# Altium project BEE-1012 PAY-EXP_V100.PrjPcb (part 1 of 4)
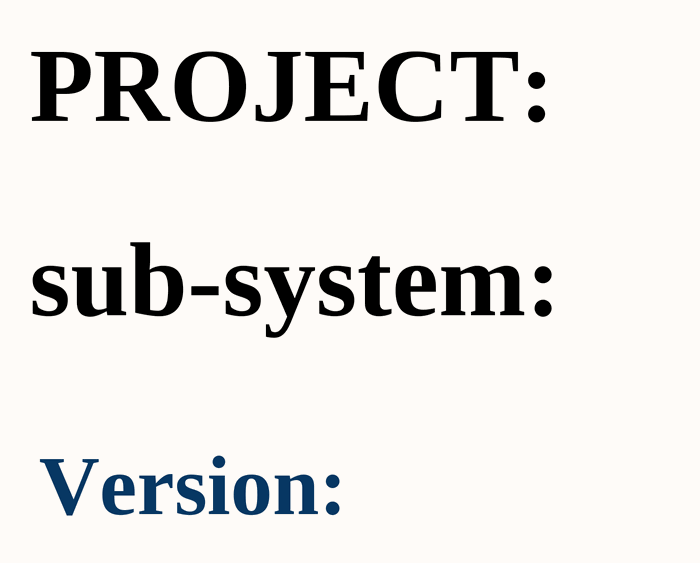
[diagram p0: 01_COVER PAGE.SchDoc]
ApprovedBy: Vu Pham; CheckedBy: Bao Bui; Date: 10/29/2025; DrawnBy: Cam Doan; MasterProject: BEE-PC; Revision: 1.0.0; SubSystem: EXP
33 sheets, 1301 parts. Net scope: flat (ports and power ports of the same name join across sheets).
Board file: BEE_1012 PAY-EXP V100.PcbDoc
Sheets:
  01_COVER PAGE.SchDoc
  02_BLOCK DIAGRAM.SchDoc
  03_INDEX.SchDoc
  04_POWER_TREE.SchDoc
  05_CONNECTOR_IN.SchDoc
  05_CONNECTOR_OUT.SchDoc
  06_POWER_1.SchDoc
  06_POWER_2.SchDoc
  06_POWER_3.SchDoc
  06_POWER_4.SchDoc
  06_POWER_5.SchDoc
  07_CAN.SchDoc
  08_SAMA7G54-MPU.SchDoc
  08_SAMA7G54-PMIC.SchDoc
  08_SAMA7G54-PIO.SchDoc
  08_SAMA7G54-DDR3.SchDoc
  08_SOM_USB_CARD.SchDoc
  09_eMMC.SchDoc
  10_USB.SchDoc
  11_MCU.SchDoc
  12_CONSOLE.SchDoc
  13_MRAM_RTC_WDT.SchDoc
  14_NTC_TEMPSENSOR.SchDoc
  15_HEATER.SchDoc
  16_TEC.SchDoc
  17_FLOW_Sensor.SchDoc
  17_I2C_Sensor_OnBoard.SchDoc
  18_HD4_PUMP.SchDoc
  18_HD4_PUMP_2.SchDoc
  19_SOLEDNOID_1.SchDoc
  19_SOLEDNOID_2.SchDoc
  MOUTING.SchDoc
  ANA_SWITCH.SchDoc

## Sheet 01_COVER PAGE.SchDoc
size 420 x 297 mm; DrawnBy: Sang Huynh; SheetNumber: 1; SheetTotal: 33; MasterProject: BEE-1012

### Notes on the sheet
- PROJECT:
- sub-system:
- Version:
- Project:
- BEE-1012
- Sub-system:
- SATELLITE_EXP_CONTROLLER
- Design by:
- SANG HUYNH
- BAO BUI
- Sheet title:
- Sheet
- A3
- of
- Checked by:
- Approved by:
- VU PHAM
- Revision:
- Document No:
- Size:
- Date:

## Sheet 02_BLOCK DIAGRAM.SchDoc
size 420 x 297 mm; SheetNumber: 2; SheetTotal: 33

### Notes on the sheet
- Project:
- BEE-1012
- Sub-system:
- SATELLITE_EXP_CONTROLLER
- Design by:
- SANG HUYNH
- BAO BUI
- Sheet title:
- Sheet
- A3
- of
- Checked by:
- Approved by:
- VU PHAM
- Revision:
- Document No:
- Size:
- Date:

## Sheet 03_INDEX.SchDoc
size 420 x 297 mm; SheetNumber: 3; SheetTotal: 33
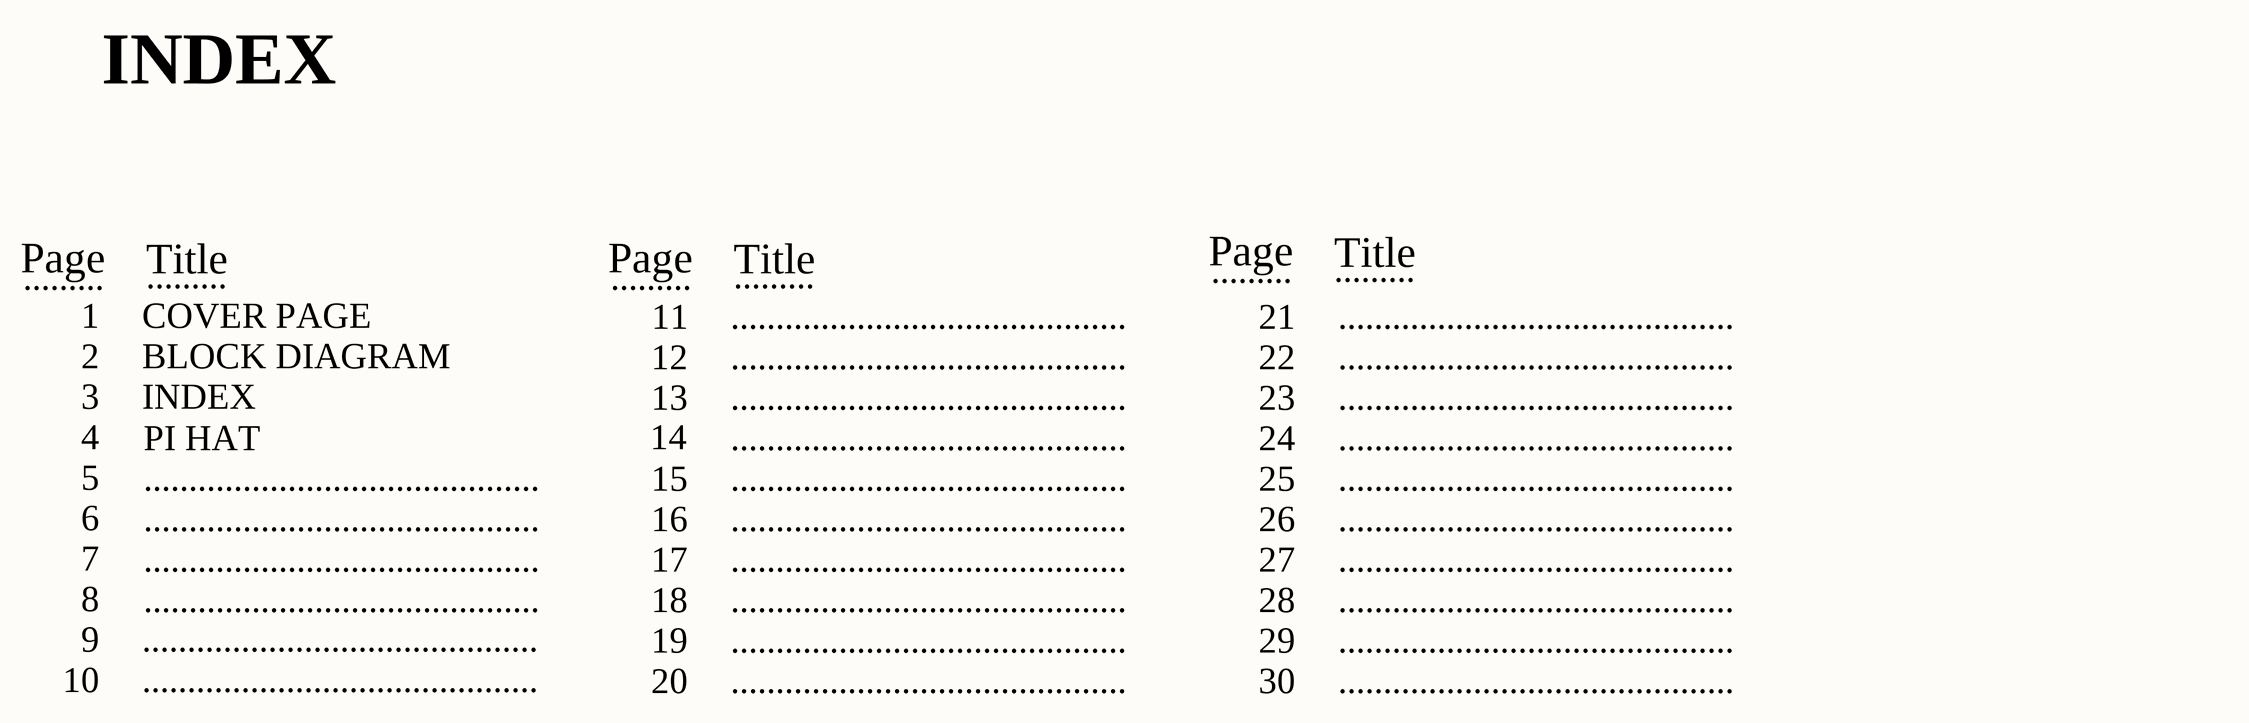
[diagram p1: 03_INDEX.SchDoc]

### Notes on the sheet
- INDEX
- Page
- .........
- Title
- 1
- 2
- COVER PAGE
- BLOCK DIAGRAM
- 11
- 12
- ............................................
- 21
- 22
- 3
- 4
- 14
- 13
- 23
- 5
- PI HAT
- 15
- 24
- 25
- 6
- 7
- 16
- 17
- 26
- 27
- 8
- 18
- 28
- 9
- 10
- 19
- 20
- 29
- 30
- Project:
- BEE-1012
- Sub-system:
- SATELLITE_EXP_CONTROLLER
- Design by:
- SANG HUYNH
- BAO BUI
- Sheet title:
- Sheet
- A3
- of
- Checked by:
- Approved by:
- VU PHAM
- Revision:
- Document No:
- Size:
- Date:

## Sheet 04_POWER_TREE.SchDoc
size 420 x 297 mm; SheetNumber: 4; SheetTotal: 33
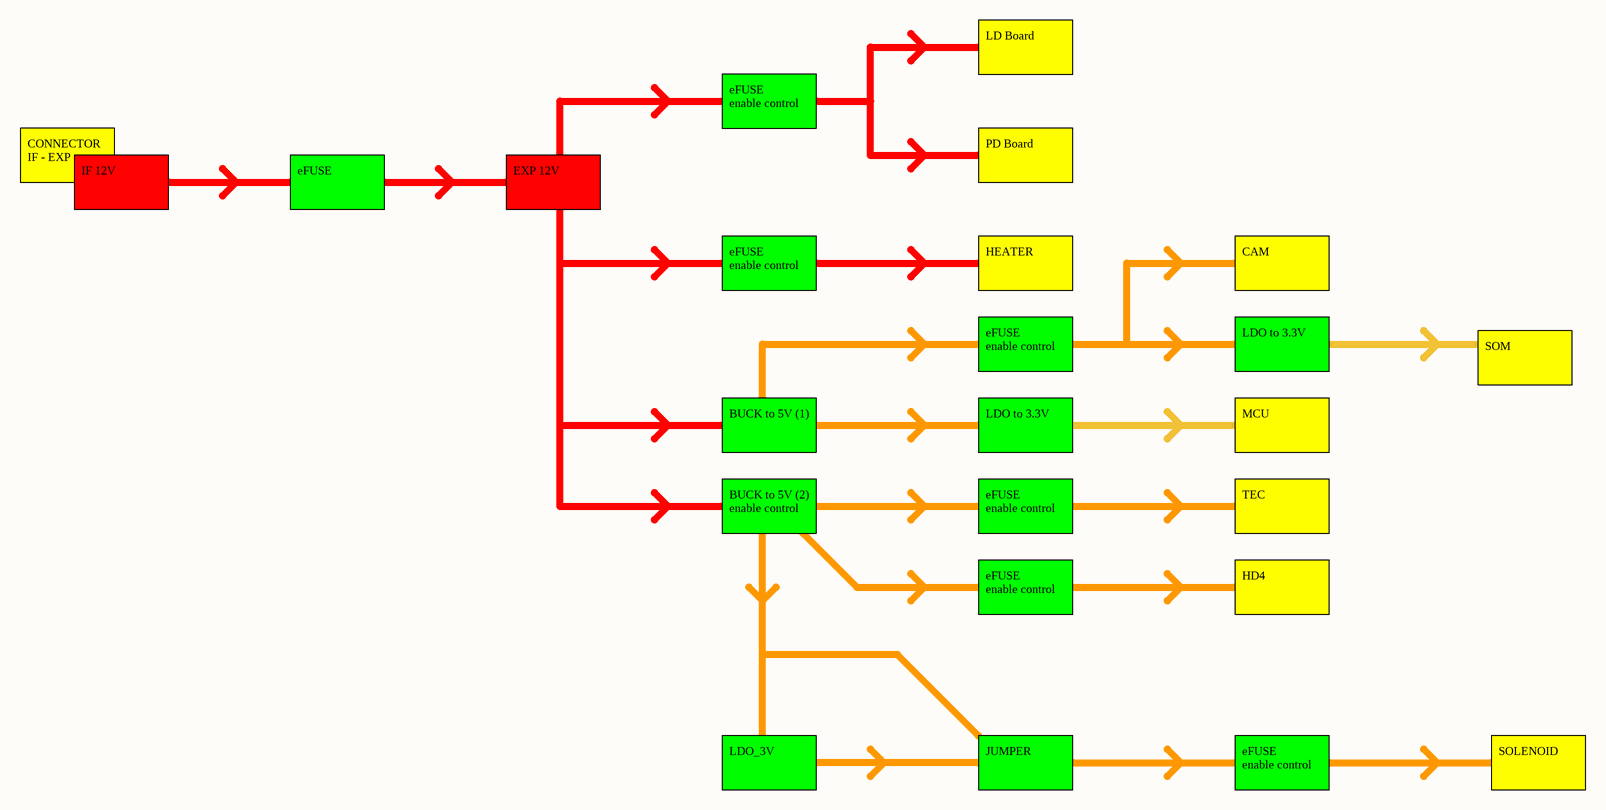
[diagram p2: 04_POWER_TREE.SchDoc]

### Notes on the sheet
- LD Board
- eFUSE
  enable control
- CONNECTOR
  IF - EXP
- IF 12V
- eFUSE
- EXP 12V
- PD Board
- HEATER
- CAM
- LDO to 3.3V
- SOM
- BUCK to 5V (1)
- MCU
- BUCK to 5V (2)
  enable control
- TEC
- HD4
- LDO_3V
- JUMPER
- SOLENOID
- Project:
- BEE-1012
- Sub-system:
- SATELLITE_EXP_CONTROLLER
- Design by:
- SANG HUYNH
- BAO BUI
- Sheet title:
- Sheet
- A3
- of
- Checked by:
- Approved by:
- VU PHAM
- Revision:
- Document No:
- Size:
- Date:

## Sheet 05_CONNECTOR_IN.SchDoc
size 420 x 297 mm; SheetNumber: 5; SheetTotal: 33
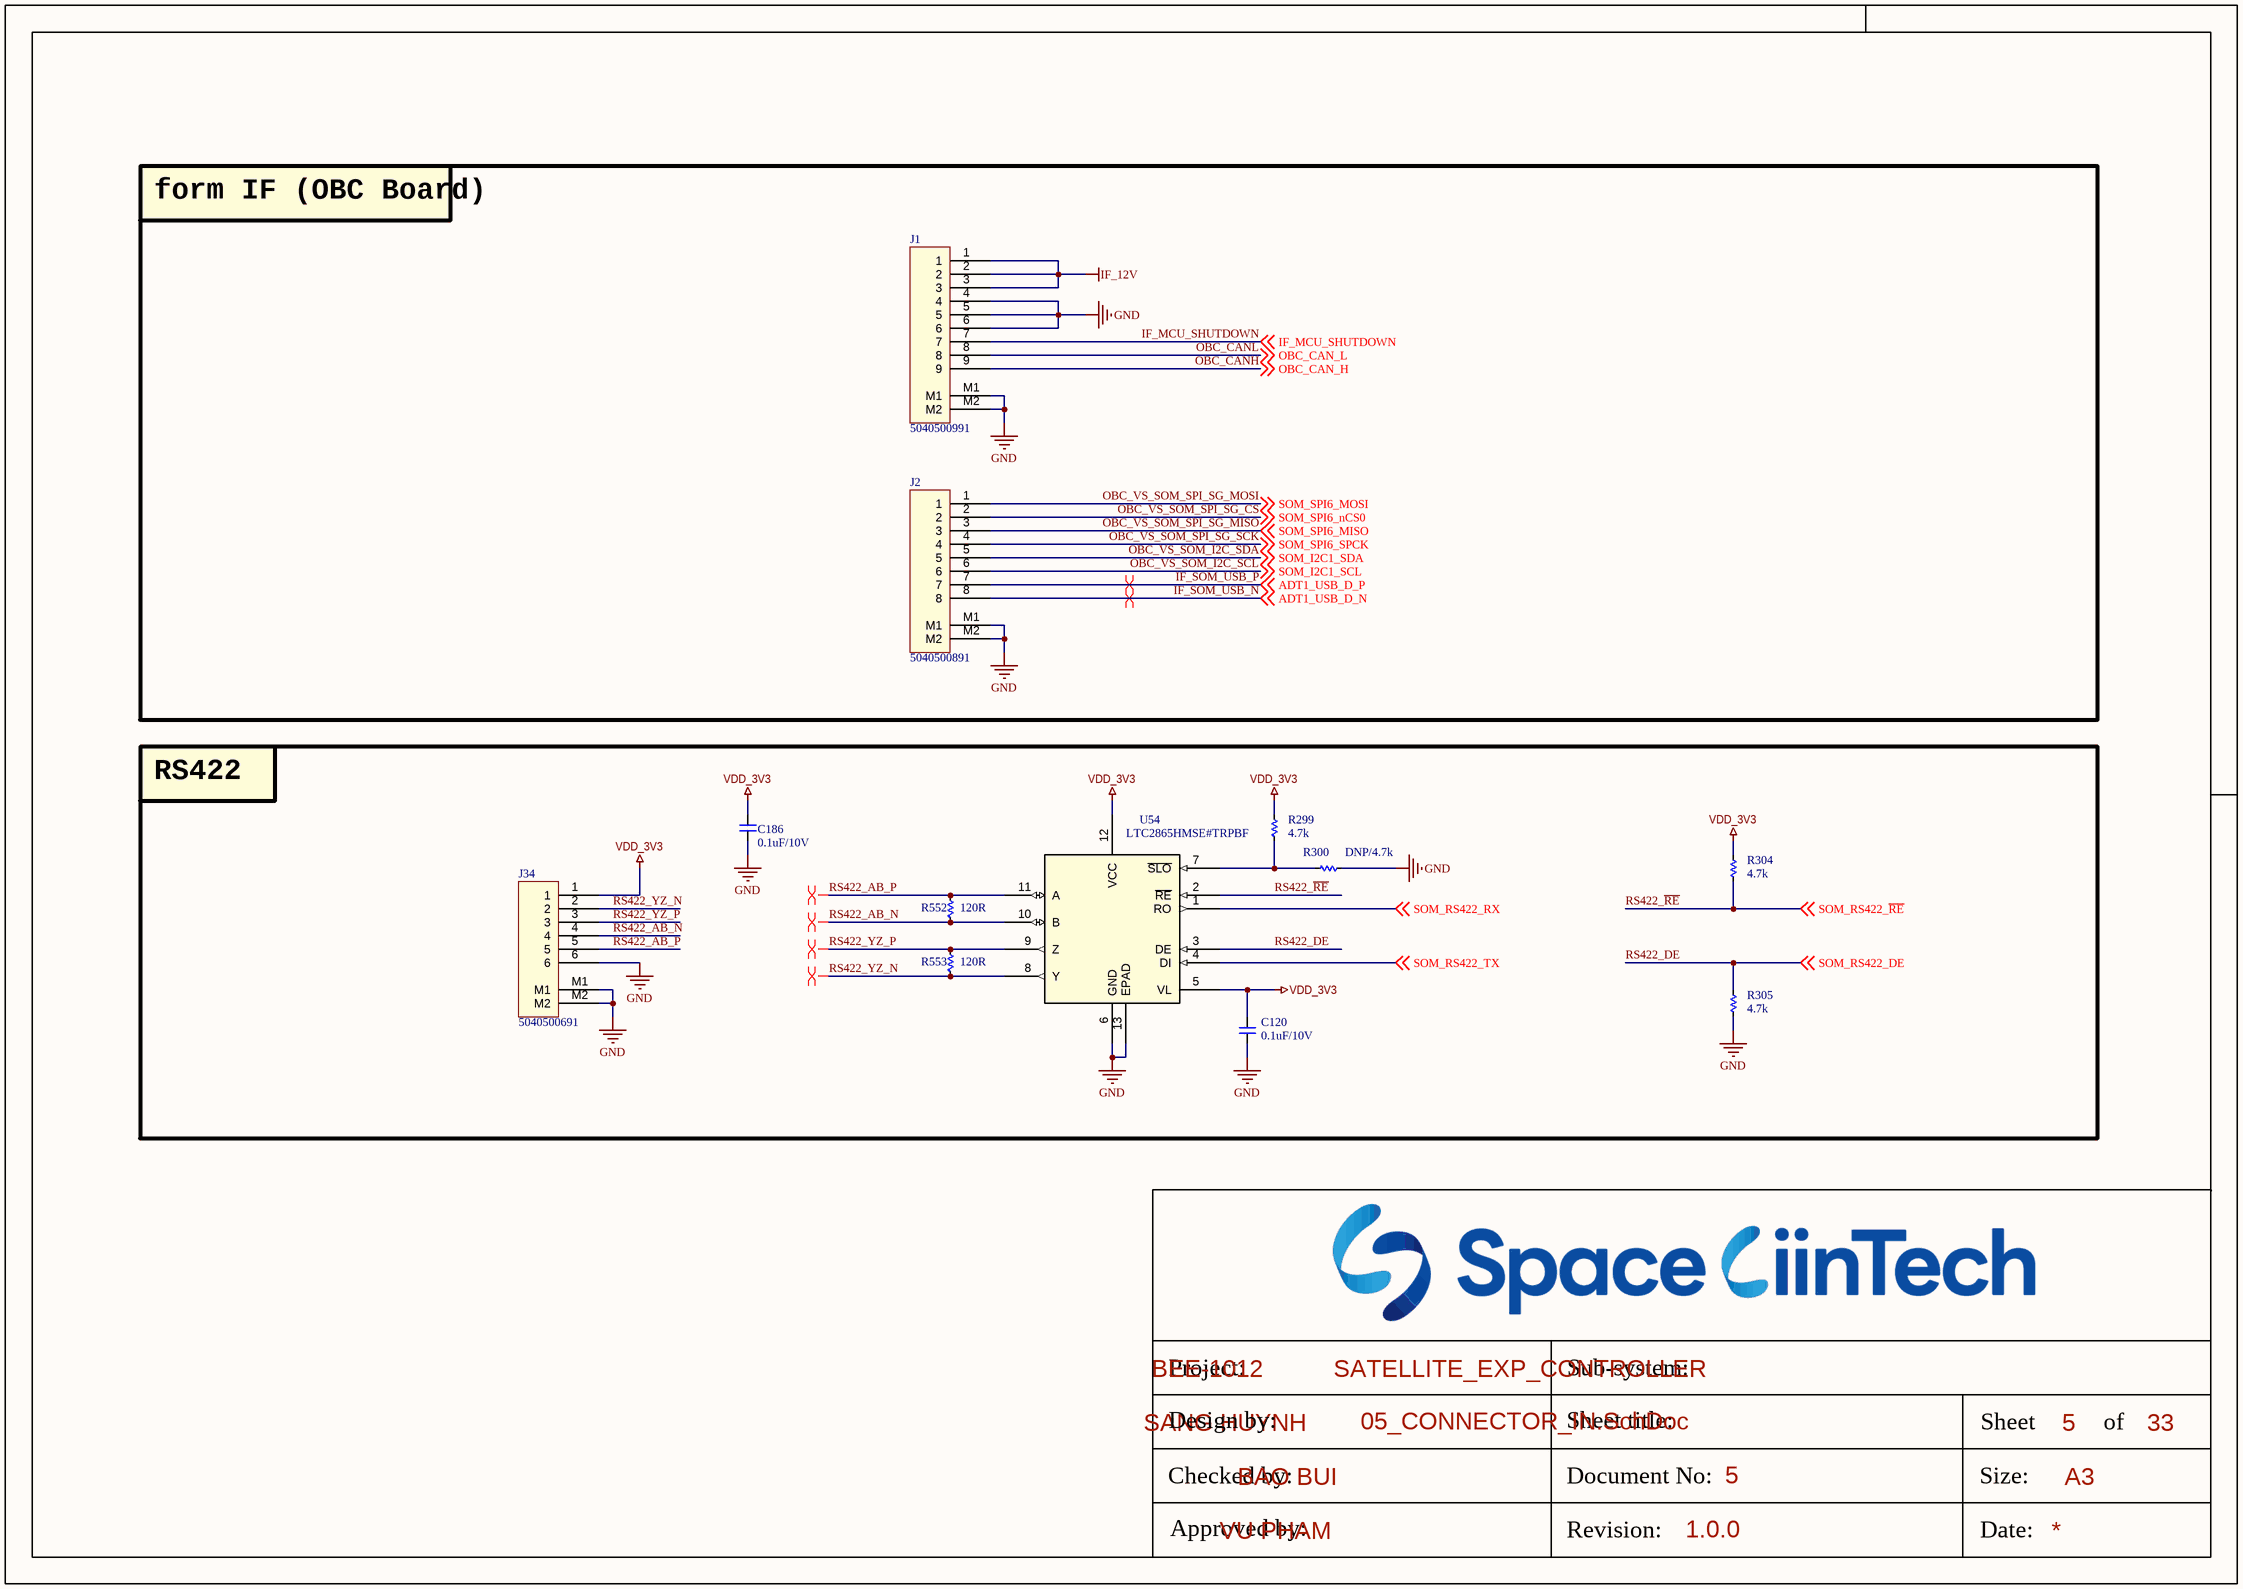
[diagram p3: 05_CONNECTOR_IN.SchDoc]

### Parts
C120  0.1uF/10V  [CAP_C_1005X50_L]
C186  0.1uF/10V  [CAP_C_1005X50_L]
J1  5040500991  [MOLEX_5040500991]
J2  5040500891  [MOLEX_5040500891]
J34  5040500691  [MOLEX_5040500691]
R299  4.7k  [RES_C_1005x30_L]
R300  DNP/4.7k  [RES_C_1005x30_L]
R304  4.7k  [RES_C_1005x30_L]
R305  4.7k  [RES_C_1005x30_L]
R552  120R  [RES_C_1005x30_L]
R553  120R  [RES_C_1005x30_L]
U54  LTC2865HMSE#TRPBF  [MSOP-12_MSE_LIT]

### Blocks framed on the sheet
form IF (OBC Board): J1 J2
RS422: C120 C186 J34 R299 R300 R304 R305 R552 R553 U54

### Nets
GND: C120.1 C186.1 J1.4 J1.5 J1.6 J1.M1 J1.M2 J2.M1 J2.M2 J34.6 J34.M1 J34.M2 R300.2 R305.1 U54.6(GND) U54.13(EPAD)
IF_12V: J1.1 J1.2 J1.3
VDD_3V3: C120.2 C186.2 J34.1 R299.1 R304.1 U54.5(VL) U54.12(VCC)
IF_MCU_SHUTDOWN: J1.7 ; off-sheet IF_MCU_SHUTDOWN
IF_SOM_USB_N: J2.8 ; off-sheet ADT1_USB_D_N  [also labelled ADT1_USB_D_N]
IF_SOM_USB_P: J2.7 ; off-sheet ADT1_USB_D_P  [also labelled ADT1_USB_D_P]
OBC_CANH: J1.9 ; off-sheet OBC_CAN_H  [also labelled OBC_CAN_H]
OBC_CANL: J1.8 ; off-sheet OBC_CAN_L  [also labelled OBC_CAN_L]
OBC_VS_SOM_I2C_SCL: J2.6 ; off-sheet SOM_I2C1_SCL  [also labelled SOM_I2C1_SCL]
OBC_VS_SOM_I2C_SDA: J2.5 ; off-sheet SOM_I2C1_SDA  [also labelled SOM_I2C1_SDA]
OBC_VS_SOM_SPI_SG_CS: J2.2 ; off-sheet SOM_SPI6_nCS0  [also labelled SOM_SPI6_nCS0]
OBC_VS_SOM_SPI_SG_MISO: J2.3 ; off-sheet SOM_SPI6_MISO  [also labelled SOM_SPI6_MISO]
OBC_VS_SOM_SPI_SG_MOSI: J2.1 ; off-sheet SOM_SPI6_MOSI  [also labelled SOM_SPI6_MOSI]
OBC_VS_SOM_SPI_SG_SCK: J2.4 ; off-sheet SOM_SPI6_SPCK  [also labelled SOM_SPI6_SPCK]
RS422_AB_N: J34.4 R552.2 U54.10(B)
RS422_AB_P: J34.5 R552.1 U54.11(A)
RS422_DE: R305.2 U54.3(DE) ; off-sheet SOM_RS422_DE  [also labelled SOM_RS422_DE]
RS422_~{RE}: R304.2 U54.2(~{RE}) ; off-sheet SOM_RS422_~{RE}  [also labelled SOM_RS422_~{RE}]
RS422_YZ_N: J34.2 R553.2 U54.8(Y)
RS422_YZ_P: J34.3 R553.1 U54.9(Z)
SOM_RS422_RX: U54.1(RO) ; off-sheet SOM_RS422_RX
SOM_RS422_TX: U54.4(DI) ; off-sheet SOM_RS422_TX
NetR299_2: R299.2 R300.1 U54.7(~{SLO})

### Layout directives
differential pair: IF_SOM_USB_N, IF_SOM_USB_P, RS422_AB_N, RS422_AB_P, RS422_YZ_N, RS422_YZ_P

### Notes on the sheet
- Project:
- BEE-1012
- Sub-system:
- SATELLITE_EXP_CONTROLLER
- Design by:
- SANG HUYNH
- BAO BUI
- Sheet title:
- Sheet
- A3
- of
- Checked by:
- Approved by:
- VU PHAM
- Revision:
- Document No:
- Size:
- Date:

### Library data of the parts
C120 C186 = _CAP_C_2: CAP CHIP
J1 = Header 9x1_2M
J2 = Header 8x1_2M
J34 = Header 6x1_2M
R299 R300 R304 R305 R552 R553 = _RES_B_2: RES
U54 = LTC2865HMSETRPBF: Â±60V Fault Protected 3V to 5.5V RS485/RS422 Transceivers; Manufacturer_Name: Analog Devices Inc; Copyright: Copyright (C) 2025 Ultra Librarian. All rights reserved.; Manufacturer_Part_Number: LTC2865HMSE#TRPBF; RefDes: RefDes; Type: Type

## Sheet 05_CONNECTOR_OUT.SchDoc
size 420 x 297 mm; SheetNumber: 6; SheetTotal: 33
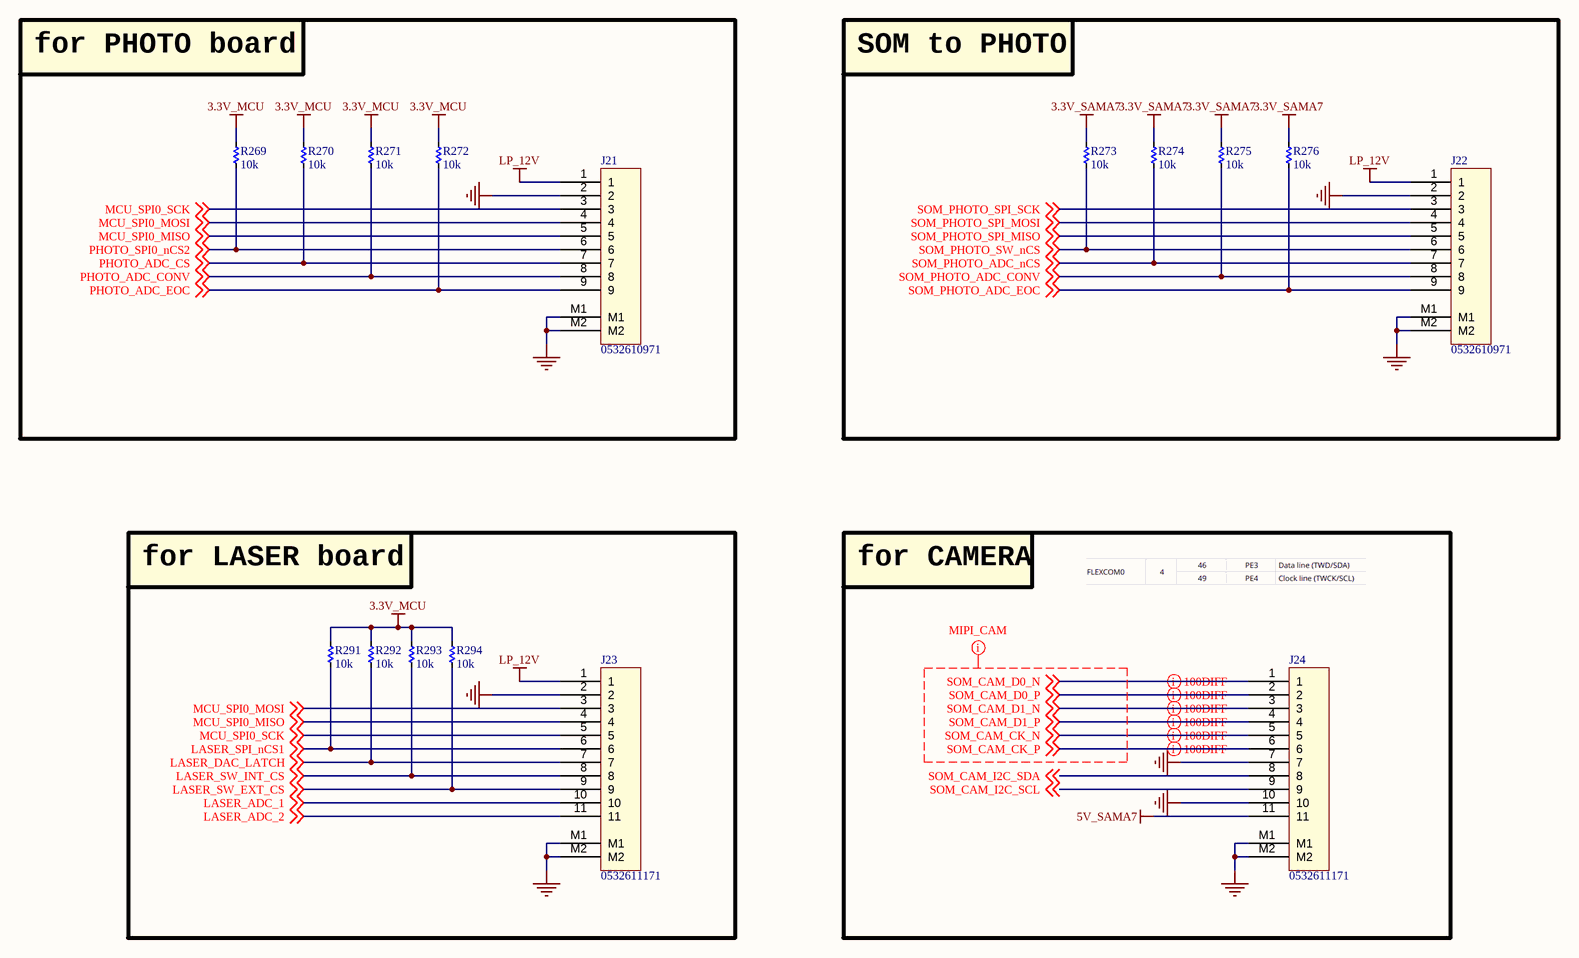
[diagram p4: 05_CONNECTOR_OUT.SchDoc]

### Parts
J21  0532610971  [MOLEX_0532610971]
J22  0532610971  [MOLEX_0532610971]
J23  0532611171  [MOLEX_0532611171]
J24  0532611171  [MOLEX_0532611171]
R269  10k  [RES_C_1005x30_L]
R270  10k  [RES_C_1005x30_L]
R271  10k  [RES_C_1005x30_L]
R272  10k  [RES_C_1005x30_L]
R273  10k  [RES_C_1005x30_L]
R274  10k  [RES_C_1005x30_L]
R275  10k  [RES_C_1005x30_L]
R276  10k  [RES_C_1005x30_L]
R291  10k  [RES_C_1005x30_L]
R292  10k  [RES_C_1005x30_L]
R293  10k  [RES_C_1005x30_L]
R294  10k  [RES_C_1005x30_L]

### Blocks framed on the sheet
for PHOTO board: J21 R269-R272
SOM to PHOTO: J22 R273-R276
for LASER board: J23 R291-R294
for CAMERA: J24

### Nets
3.3V_MCU: R269.1 R270.1 R271.1 R272.1 R291.1 R292.1 R293.1 R294.1
3.3V_SAMA7: R273.1 R274.1 R275.1 R276.1
5V_SAMA7: J24.11
GND: J21.2 J21.M1 J21.M2 J22.2 J22.M1 J22.M2 J23.2 J23.M1 J23.M2 J24.7 J24.10 J24.M1 J24.M2
LP_12V: J21.1 J22.1 J23.1
LASER_ADC_1: J23.10 ; off-sheet LASER_ADC_1
LASER_ADC_2: J23.11 ; off-sheet LASER_ADC_2
LASER_DAC_LATCH: J23.7 R292.2 ; off-sheet LASER_DAC_LATCH
LASER_SPI_nCS1: J23.6 R291.2 ; off-sheet LASER_SPI_nCS1
LASER_SW_EXT_CS: J23.9 R294.2 ; off-sheet LASER_SW_EXT_CS
LASER_SW_INT_CS: J23.8 R293.2 ; off-sheet LASER_SW_INT_CS
MCU_SPI0_MISO: J21.5 J23.4 ; off-sheet MCU_SPI0_MISO
MCU_SPI0_MOSI: J21.4 J23.3 ; off-sheet MCU_SPI0_MOSI
MCU_SPI0_SCK: J21.3 J23.5 ; off-sheet MCU_SPI0_SCK
PHOTO_ADC_CONV: J21.8 R271.2 ; off-sheet PHOTO_ADC_CONV
PHOTO_ADC_CS: J21.7 R270.2 ; off-sheet PHOTO_ADC_CS
PHOTO_ADC_EOC: J21.9 R272.2 ; off-sheet PHOTO_ADC_EOC
PHOTO_SPI0_nCS2: J21.6 R269.2 ; off-sheet PHOTO_SPI0_nCS2
SOM_CAM_CK_N: J24.5 ; off-sheet SOM_CAM_CK_N  [project net MIPI_CK_N]
SOM_CAM_CK_P: J24.6 ; off-sheet SOM_CAM_CK_P  [project net MIPI_CK_P]
SOM_CAM_D0_N: J24.1 ; off-sheet SOM_CAM_D0_N  [project net MIPI_D0_N]
SOM_CAM_D0_P: J24.2 ; off-sheet SOM_CAM_D0_P  [project net MIPI_D0_P]
SOM_CAM_D1_N: J24.3 ; off-sheet SOM_CAM_D1_N  [project net MIPI_D1_N]
SOM_CAM_D1_P: J24.4 ; off-sheet SOM_CAM_D1_P  [project net MIPI_D1_P]
SOM_CAM_I2C_SCL: J24.9 ; off-sheet SOM_CAM_I2C_SCL
SOM_CAM_I2C_SDA: J24.8 ; off-sheet SOM_CAM_I2C_SDA
SOM_PHOTO_ADC_CONV: J22.8 R275.2 ; off-sheet SOM_PHOTO_ADC_CONV
SOM_PHOTO_ADC_EOC: J22.9 R276.2 ; off-sheet SOM_PHOTO_ADC_EOC
SOM_PHOTO_ADC_nCS: J22.7 R274.2 ; off-sheet SOM_PHOTO_ADC_nCS
SOM_PHOTO_SPI_MISO: J22.5 ; off-sheet SOM_PHOTO_SPI_MISO
SOM_PHOTO_SPI_MOSI: J22.4 ; off-sheet SOM_PHOTO_SPI_MOSI
SOM_PHOTO_SPI_SCK: J22.3 ; off-sheet SOM_PHOTO_SPI_SCK
SOM_PHOTO_SW_nCS: J22.6 R273.2 ; off-sheet SOM_PHOTO_SW_nCS

### Layout directives
differential pair; differential pair class DIFF100: MIPI_CK_N, MIPI_CK_P, MIPI_D0_N, MIPI_D0_P, MIPI_D1_N, MIPI_D1_P
net class MIPI_CAM: SOM_CAM_CK_N, SOM_CAM_CK_P, SOM_CAM_D0_N, SOM_CAM_D0_P, SOM_CAM_D1_N, SOM_CAM_D1_P

### Notes on the sheet
- Project:
- BEE-1012
- Sub-system:
- SATELLITE_EXP_CONTROLLER
- Design by:
- SANG HUYNH
- BAO BUI
- Sheet title:
- Sheet
- A3
- of
- Checked by:
- Approved by:
- VU PHAM
- Revision:
- Document No:
- Size:
- Date:

### Library data of the parts
J21 J22 = Header 9x1_2M
J23 J24 = Header 11x1_2M
R269-R276 R291-R294 = _RES_B_2: RES

## Sheet 06_POWER_1.SchDoc
size 420 x 297 mm; SheetNumber: 7; SheetTotal: 33
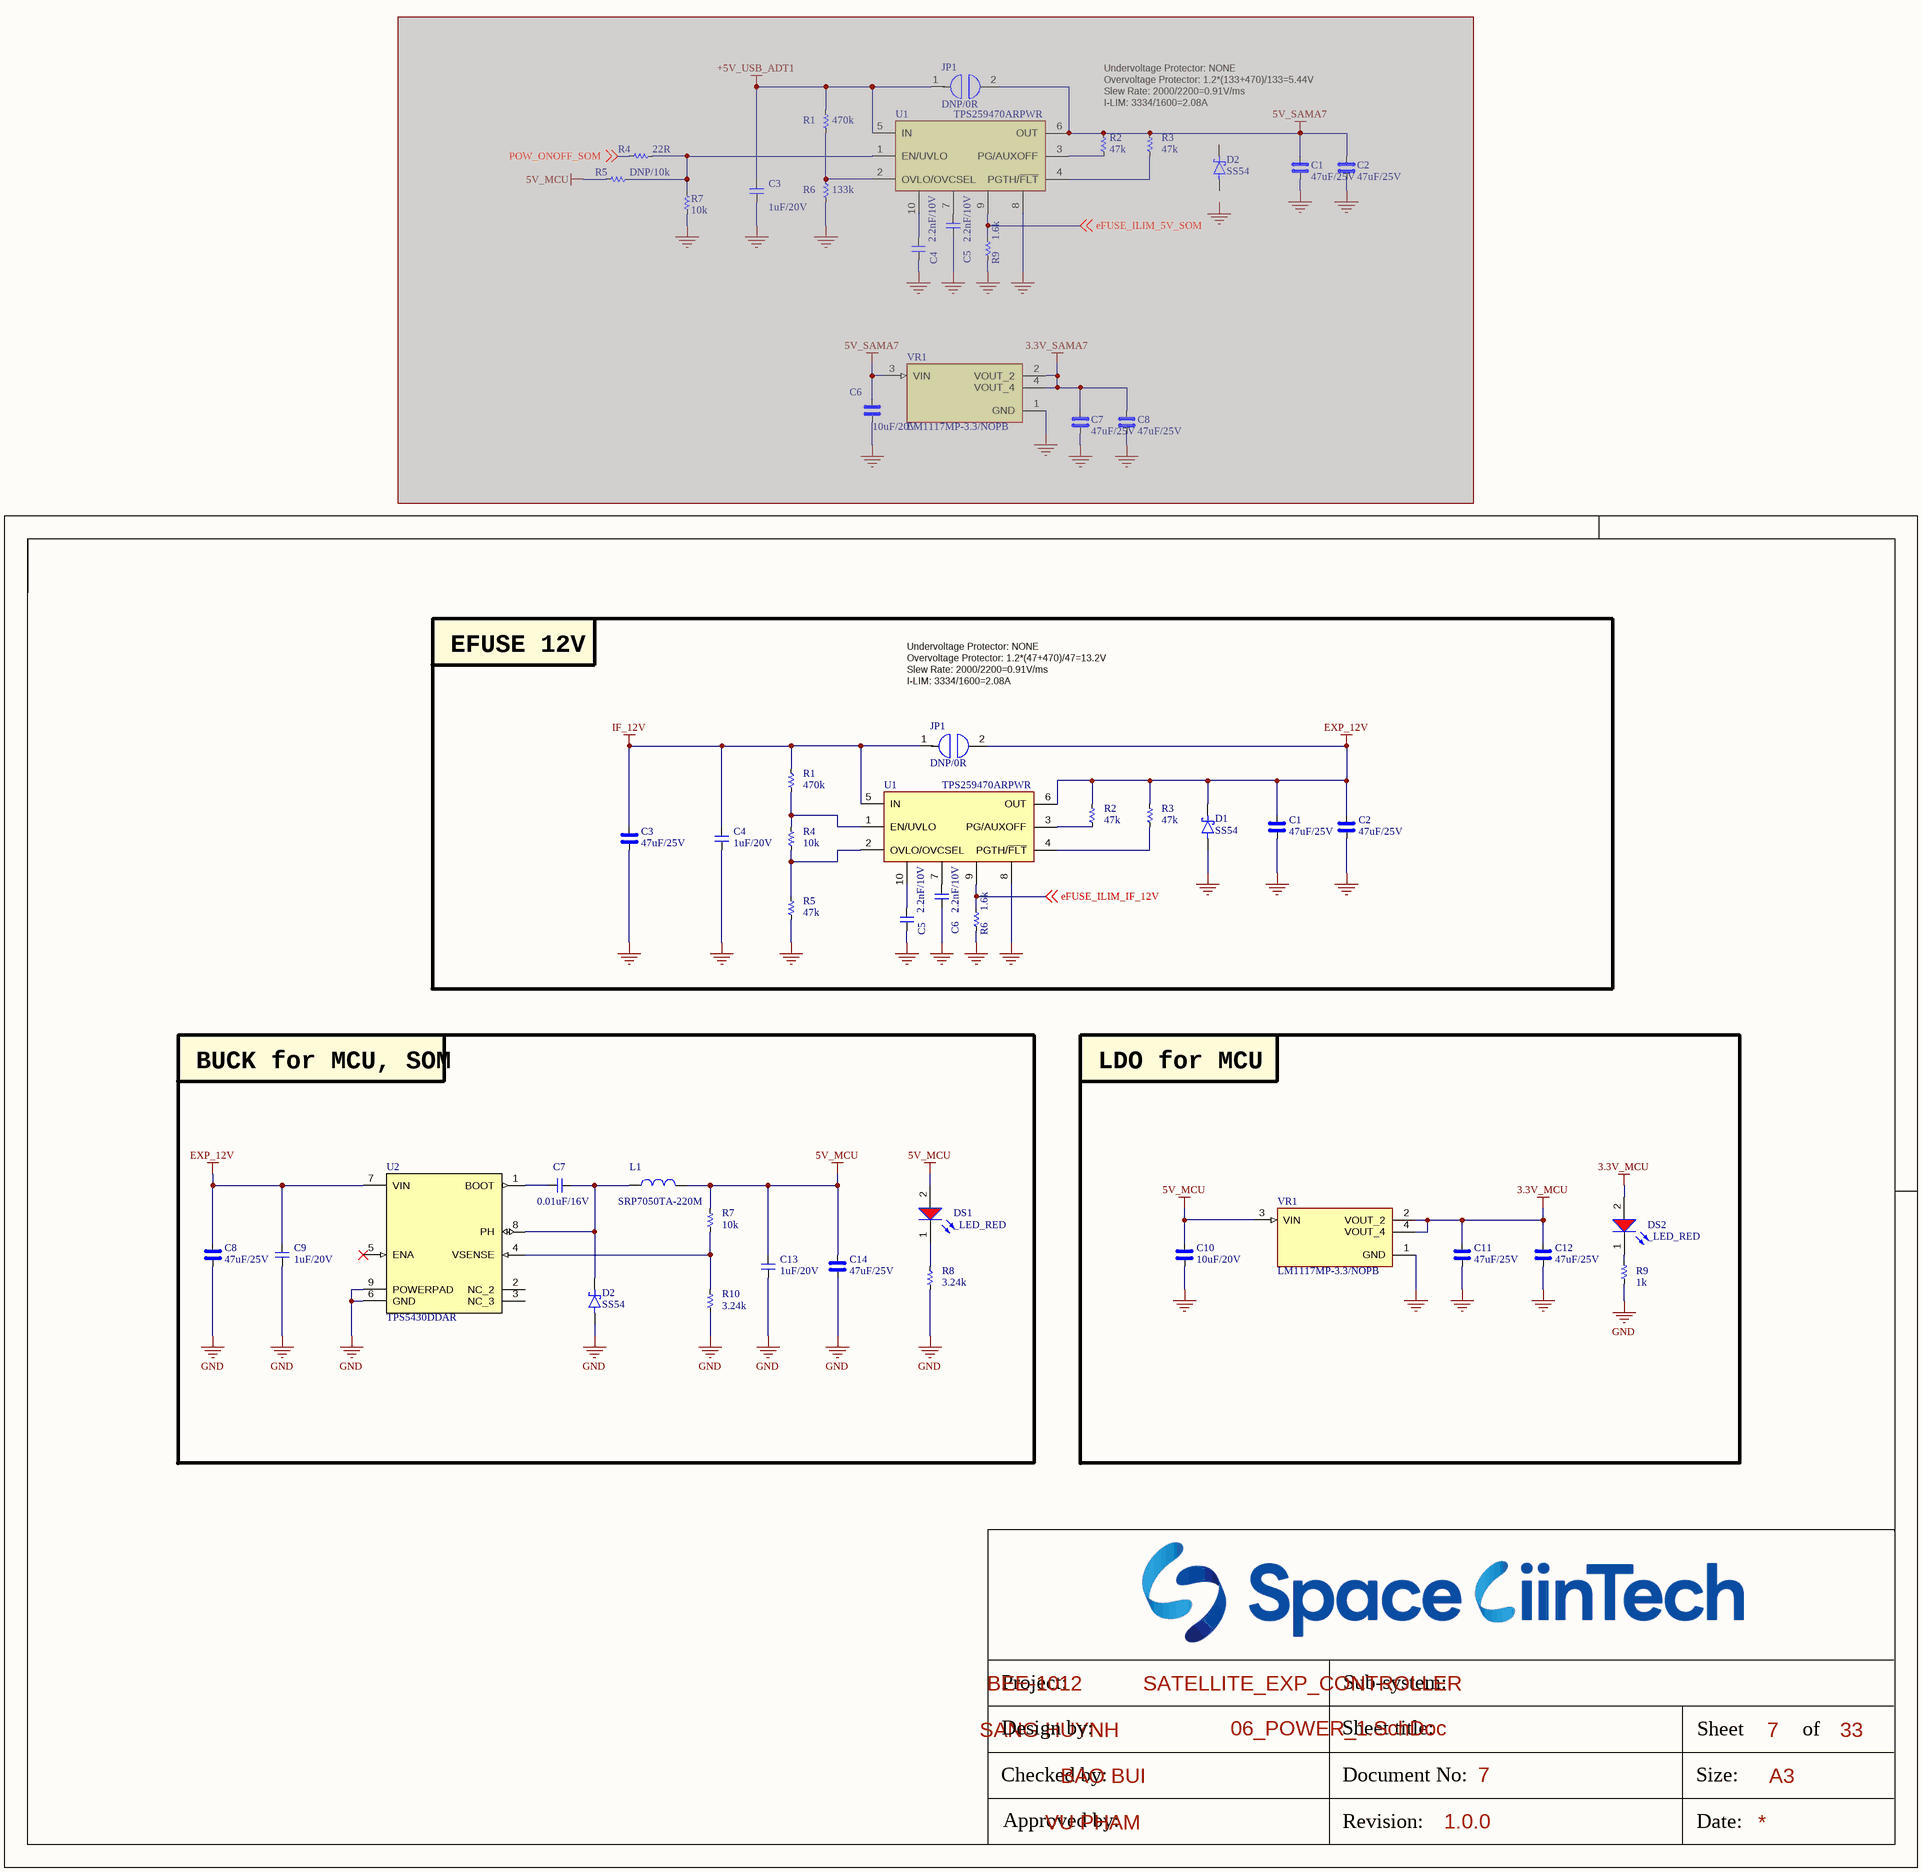
[diagram p5: 06_POWER_1.SchDoc]

### Parts
(Parts that share a designator on the sheet are numbered #1, #2 ... from top to bottom, then left to right.)
C1#1  47uF/25V  [CAP_C_3225X80]  (masked out: inside a compile mask, not in the netlist)
C1#2  47uF/25V  [CAP_C_3225X80]
C2#1  47uF/25V  [CAP_C_3225X80]  (masked out: inside a compile mask, not in the netlist)
C2#2  47uF/25V  [CAP_C_3225X80]
C3#1  1uF/20V  [CAP_C_1005X50_L]  (masked out: inside a compile mask, not in the netlist)
C3#2  47uF/25V  [CAP_C_3225X80]
C4#1  2.2nF/10V  [CAP_C_1005X50_L]  (masked out: inside a compile mask, not in the netlist)
C4#2  1uF/20V  [CAP_C_1005X50_L]
C5#1  2.2nF/10V  [CAP_C_1005X50_L]  (masked out: inside a compile mask, not in the netlist)
C5#2  2.2nF/10V  [CAP_C_1005X50_L]
C6#1  10uF/20V  [CAP_C_2012X110]  (masked out: inside a compile mask, not in the netlist)
C6#2  2.2nF/10V  [CAP_C_1005X50_L]
C7#1  47uF/25V  [CAP_C_3225X80]  (masked out: inside a compile mask, not in the netlist)
C7#2  0.01uF/16V  [CAP_C_1608X80]
C8#1  47uF/25V  [CAP_C_3225X80]  (masked out: inside a compile mask, not in the netlist)
C8#2  47uF/25V  [CAP_C_3225X80]
C9  1uF/20V  [CAP_C_1005X50_L]
C10  10uF/20V  [CAP_C_2012X110]
C11  47uF/25V  [CAP_C_3225X80]
C12  47uF/25V  [CAP_C_3225X80]
C13  1uF/20V  [CAP_C_1005X50_L]
C14  47uF/25V  [CAP_C_3225X80]
D1  SS54  [DO-214AC_SMA]
D2#1  SS54  [DO-214AC_SMA]  (masked out: inside a compile mask, not in the netlist)
D2#2  SS54  [DO-214AC_SMA]
DS1  _LED_RED  [LED_0402]
DS2  _LED_RED  [LED_0402]
JP1#1  DNP/0R  [JUMPER_1608]  (masked out: inside a compile mask, not in the netlist)
JP1#2  DNP/0R  [JUMPER_1608]
L1  SRP7050TA-220M  [PSM6050]
R1#1  470k  [RES_C_1005x30_L]  (masked out: inside a compile mask, not in the netlist)
R1#2  470k  [RES_C_1005x30_L]
R2#1  47k  [RES_C_1005x30_L]  (masked out: inside a compile mask, not in the netlist)
R2#2  47k  [RES_C_1005x30_L]
R3#1  47k  [RES_C_1005x30_L]  (masked out: inside a compile mask, not in the netlist)
R3#2  47k  [RES_C_1005x30_L]
R4#1  22R  [RES_C_1005x30_L]  (masked out: inside a compile mask, not in the netlist)
R4#2  10k  [RES_C_1005x30_L]
R5#1  DNP/10k  [RES_C_1005x30_L]  (masked out: inside a compile mask, not in the netlist)
R5#2  47k  [RES_C_1005x30_L]
R6#1  133k  [RES_C_1005x30_L]  (masked out: inside a compile mask, not in the netlist)
R6#2  1.6k  [RES_C_1005x30_L]
R7#1  10k  [RES_C_1005x30_L]  (masked out: inside a compile mask, not in the netlist)
R7#2  10k  [RES_C_1005x30_L]
R8  3.24k  [RES_C_1005x30_L]
R9#1  1.6k  [RES_C_1005x30_L]  (masked out: inside a compile mask, not in the netlist)
R9#2  1k  [RES_C_1005x30_L]
R10  3.24k  [RES_C_1005x30_L]
U1#1  TPS259470ARPWR  [VQFN-HR-10]  (masked out: inside a compile mask, not in the netlist)
U1#2  TPS259470ARPWR  [VQFN-HR-10]
U2  TPS5430DDAR  [TPS5430DDAR_V3]
VR1#1  LM1117MP-3.3/NOPB  [VREG_LM1117MP-3.3/NOPB]  (masked out: inside a compile mask, not in the netlist)
VR1#2  LM1117MP-3.3/NOPB  [VREG_LM1117MP-3.3/NOPB]

### Blocks framed on the sheet
EFUSE 12V: C1#2 C2#2 C3#2 C4#2 C5#2 C6#2 D1 JP1#2 R1#2 R2#2 R3#2 R4#2 R5#2 R6#2 U1#2
BUCK for MCU, SOM: C7#2 C8#2 C9 C13 C14 D2#2 DS1 L1 R7#2 R8 R10 U2
LDO for MCU: C10-C12 DS2 R9#2 VR1#2

### Nets
3.3V_MCU: C11.2 C12.2 DS2.2(A) VR1#2.2(VOUT_2) VR1#2.4(VOUT_4)
5V_MCU: C10.1 C13.2 C14.2 DS1.2(A) L1.2 R7#2.2 VR1#2.3(VIN)
EXP_12V: C1#2.2 C2#2.2 C8#2.2 C9.2 D1.1(K) JP1#2.2 R2#2.2 R3#2.2 U1#2.6(OUT) U2.7(VIN)
GND: C1#2.1 C2#2.1 C3#2.1 C4#2.1 C5#2.1 C6#2.1 C8#2.1 C9.1 C10.2 C11.1 C12.1 C13.1 C14.1 D1.2(A) D2#2.2(A) R5#2.1 R6#2.1 R8.1 R9#2.1 R10.1 U1#2.8 U2.6(GND) U2.9(POWERPAD) VR1#2.1(GND)
IF_12V: C3#2.2 C4#2.2 JP1#2.1 R1#2.2 U1#2.5(IN)
eFUSE_ILIM_IF_12V: R6#2.2 U1#2.9 ; off-sheet eFUSE_ILIM_IF_12V
NetC5#2_2: C5#2.2 U1#2.10
NetC6#2_2: C6#2.2 U1#2.7
NetC7#2_1: C7#2.1 D2#2.1(K) L1.1 U2.8(PH)
NetC7#2_2: C7#2.2 U2.1(BOOT)
NetDS1_1: DS1.1(K) R8.2
NetDS2_1: DS2.1(K) R9#2.2
NetR1#2_1: R1#2.1 R4#2.1 U1#2.1(EN/UVLO)
NetR2#2_1: R2#2.1 U1#2.3(PG/AUXOFF)
NetR3#2_1: R3#2.1 U1#2.4(PGTH/~{FLT})
NetR4#2_2: R4#2.2 R5#2.2 U1#2.2(OVLO/OVCSEL)
NetR7#2_1: R7#2.1 R10.2 U2.4(VSENSE)

Not connected (* = marked no-connect by the designer): U2 2(NC_2) 3(NC_3) 5(ENA)*

### Notes on the sheet
- Undervoltage Protector: NONE
- Overvoltage Protector: 1.2*(133+470)/133=5.44V
- Slew Rate: 2000/2200=0.91V/ms
- I-LIM: 3334/1600=2.08A
- Overvoltage Protector: 1.2*(47+470)/47=13.2V
- Project:
- BEE-1012
- Sub-system:
- SATELLITE_EXP_CONTROLLER
- Design by:
- SANG HUYNH
- BAO BUI
- Sheet title:
- Sheet
- A3
- of
- Checked by:
- Approved by:
- VU PHAM
- Revision:
- Document No:
- Size:
- Date:

### Library data of the parts
C1#1 C1#2 C2#1 C2#2 C3#2 C6#1 C7#1 C8#1 C8#2 C10-C12 C14 = _CAP_C_High_2: CAP High Value
C3#1 C4#1 C4#2 C5#1 C5#2 C6#2 C7#2 C9 C13 = _CAP_C_2: CAP
D1 D2#1 D2#2 = DIODE SCHOTTKY
JP1#1 JP1#2 = JUMPER
L1 = SRP7050TA-220M: FIXED IND 22UH 2.5A 170 MOHM SMD
R1#1 R1#2 R2#1 R2#2 R3#1 R3#2 R4#1 R4#2 R5#1 R5#2 R6#1 R6#2 R7#1 R7#2 R8 R9#1 R9#2 R10 = _RES_B_2: RES
U2 = TPS5430DDAR: IC REG BUCK ADJ 3A 8SOPWR
VR1#1 VR1#2 = LM1117MP-3.3/NOPB: 800-mA 15-V linear voltage regulator; MF: Texas Instruments; SnapEDA_Link: https://www.snapeda.com/parts/LM1117MP-3.3/NOPB/Texas+Instruments/view-part/?ref=snap; Package: SOT-223-4 Texas Instruments; Value: *; MP: LM1117MP-3.3/NOPB; Check_prices: https://www.snapeda.com/parts/LM1117MP-3.3/NOPB/Texas+Instruments/view-part/?ref=eda

## Sheet 06_POWER_2.SchDoc
size 420 x 297 mm; SheetNumber: 8; SheetTotal: 33
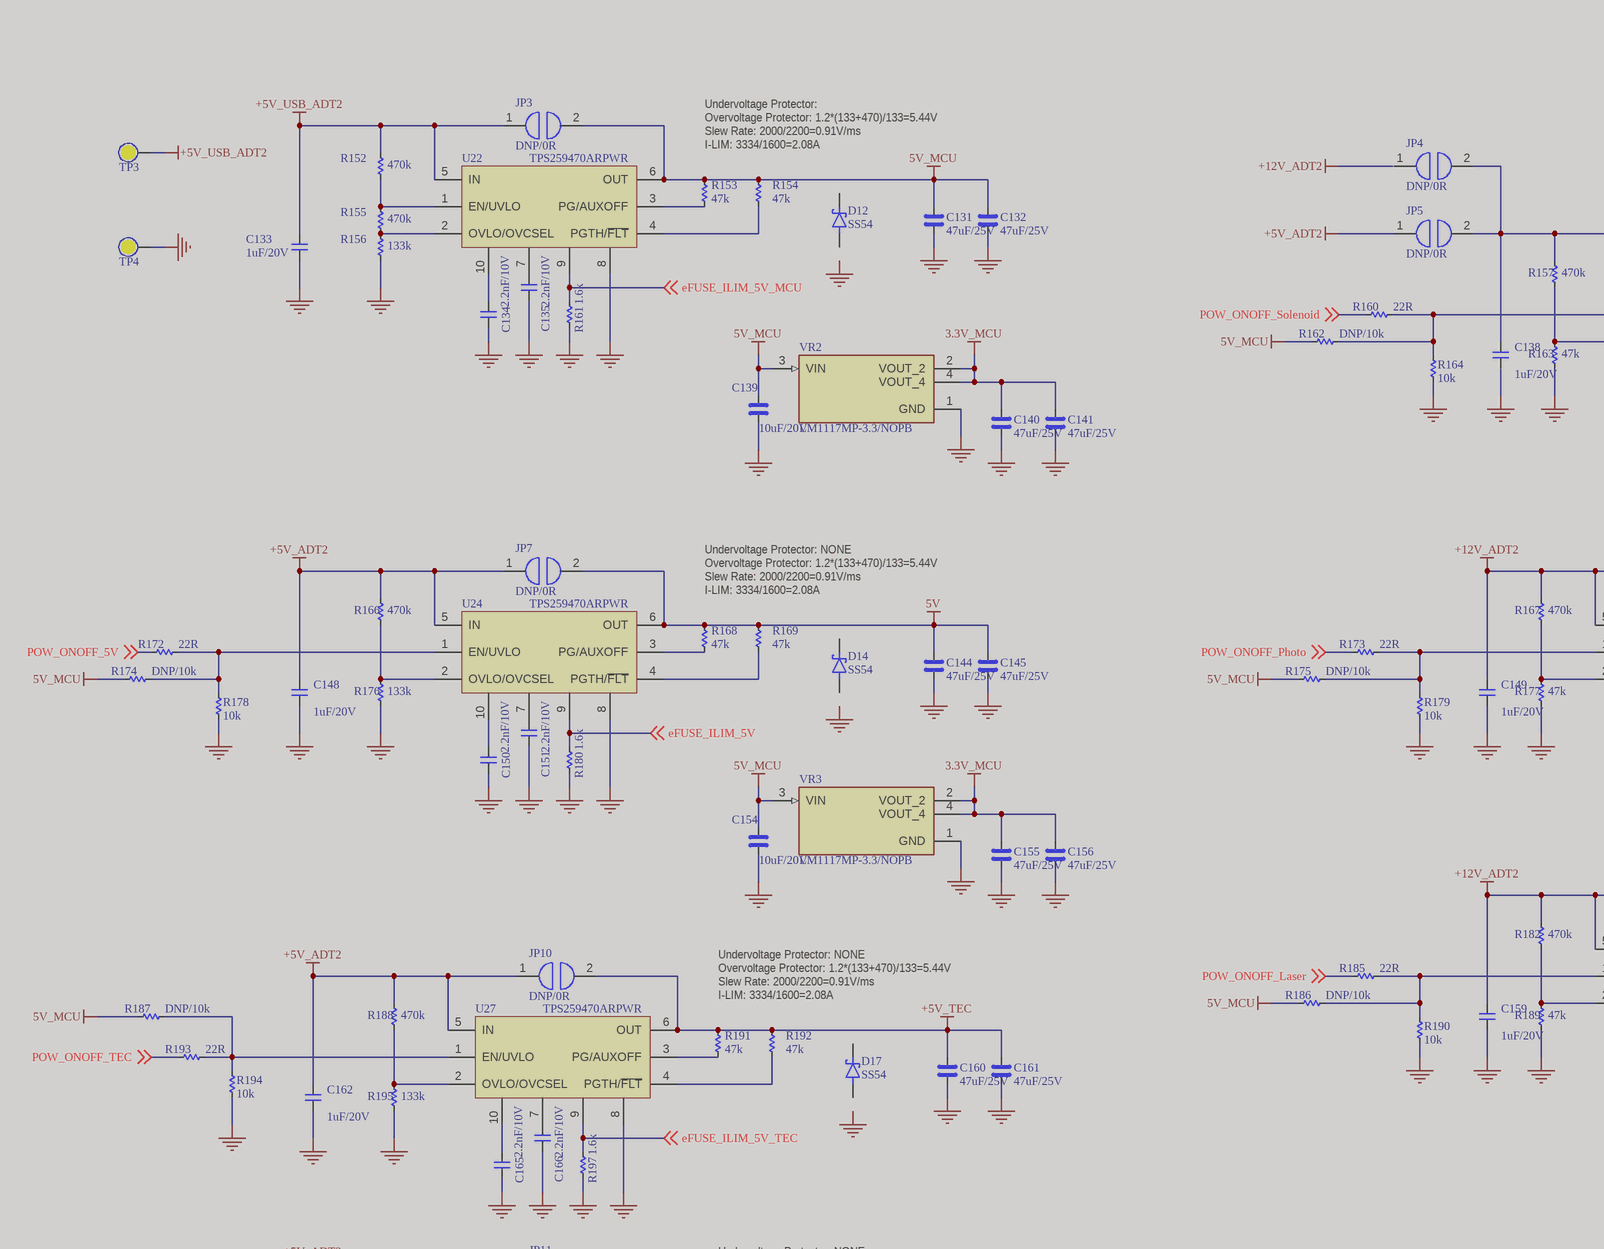
[diagram p6: 06_POWER_2.SchDoc, top left]
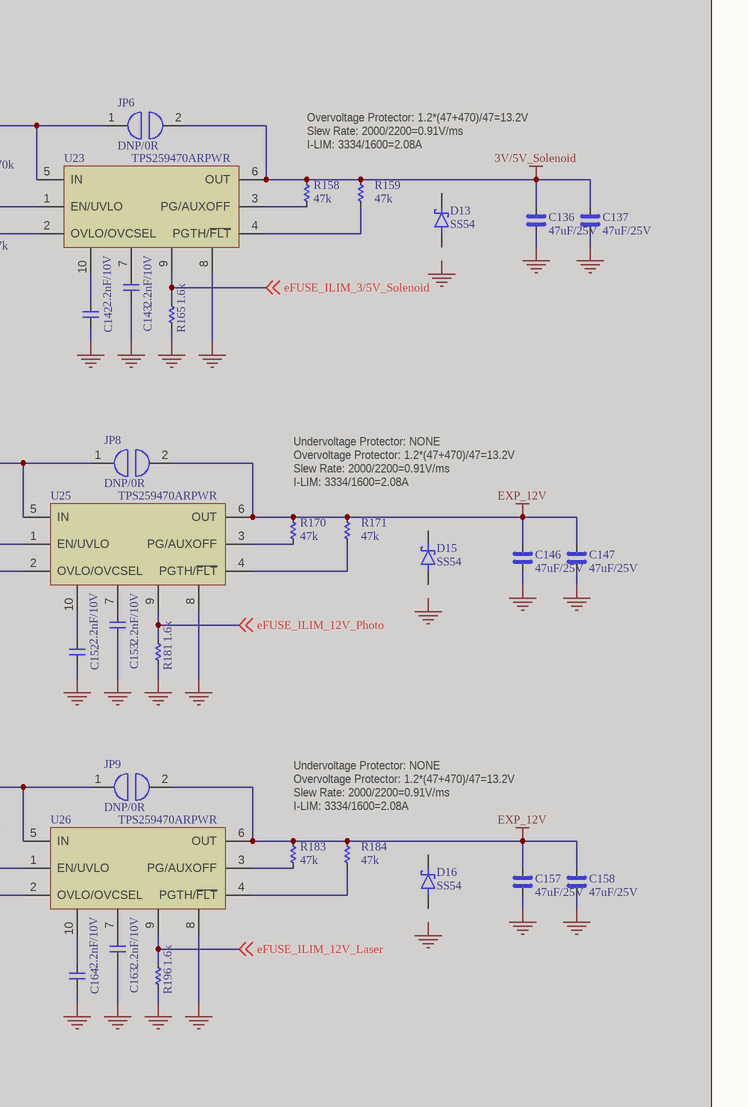
[diagram p7: 06_POWER_2.SchDoc, top right]
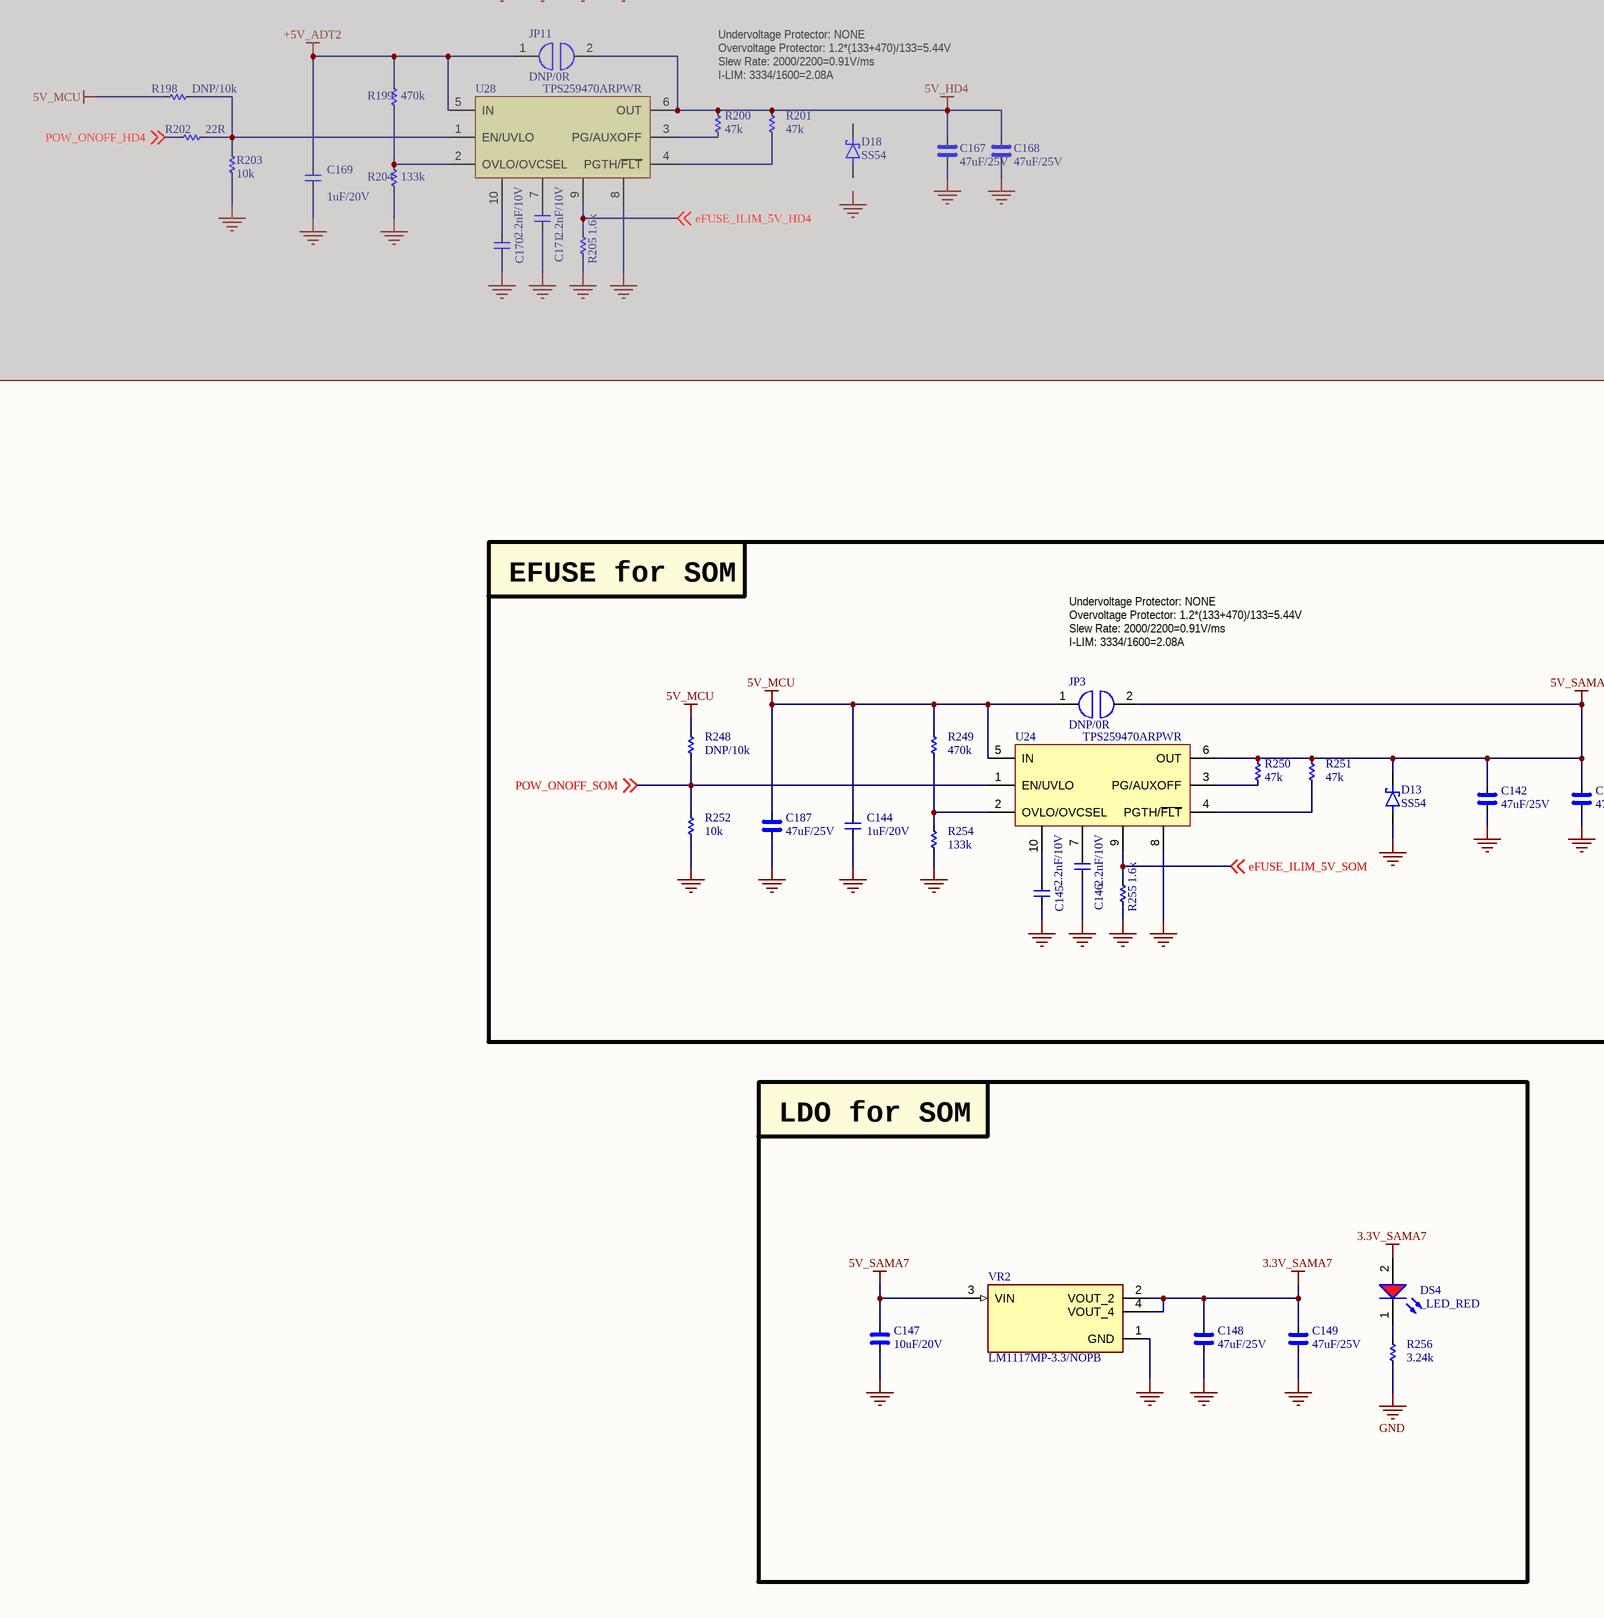
[diagram p8: 06_POWER_2.SchDoc, bottom left]
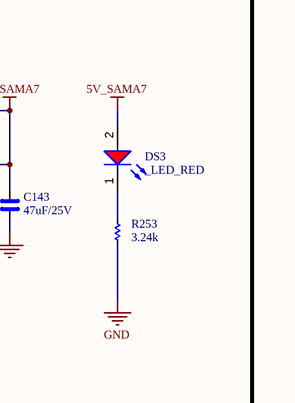
[diagram p9: 06_POWER_2.SchDoc, bottom right]

### Parts
(Parts that share a designator on the sheet are numbered #1, #2 ... from top to bottom, then left to right.)
C131#1  47uF/25V  [CAP_C_3225X80]  (masked out: inside a compile mask, not in the netlist)
C132#1  47uF/25V  [CAP_C_3225X80]  (masked out: inside a compile mask, not in the netlist)
C133#1  1uF/20V  [CAP_C_1005X50_L]  (masked out: inside a compile mask, not in the netlist)
C134#1  2.2nF/10V  [CAP_C_1005X50_L]  (masked out: inside a compile mask, not in the netlist)
C135#1  2.2nF/10V  [CAP_C_1005X50_L]  (masked out: inside a compile mask, not in the netlist)
C136#1  47uF/25V  [CAP_C_3225X80]  (masked out: inside a compile mask, not in the netlist)
C137#1  47uF/25V  [CAP_C_3225X80]  (masked out: inside a compile mask, not in the netlist)
C138#1  1uF/20V  [CAP_C_1005X50_L]  (masked out: inside a compile mask, not in the netlist)
C139#1  10uF/20V  [CAP_C_2012X110]  (masked out: inside a compile mask, not in the netlist)
C140#1  47uF/25V  [CAP_C_3225X80]  (masked out: inside a compile mask, not in the netlist)
C141#1  47uF/25V  [CAP_C_3225X80]  (masked out: inside a compile mask, not in the netlist)
C142#1  2.2nF/10V  [CAP_C_1005X50_L]  (masked out: inside a compile mask, not in the netlist)
C142#2  47uF/25V  [CAP_C_3225X80]
C143#1  2.2nF/10V  [CAP_C_1005X50_L]  (masked out: inside a compile mask, not in the netlist)
C143#2  47uF/25V  [CAP_C_3225X80]
C144#1  47uF/25V  [CAP_C_3225X80]  (masked out: inside a compile mask, not in the netlist)
C144#2  1uF/20V  [CAP_C_1005X50_L]
C145#1  47uF/25V  [CAP_C_3225X80]  (masked out: inside a compile mask, not in the netlist)
C145#2  2.2nF/10V  [CAP_C_1005X50_L]
C146#1  47uF/25V  [CAP_C_3225X80]  (masked out: inside a compile mask, not in the netlist)
C146#2  2.2nF/10V  [CAP_C_1005X50_L]
C147#1  47uF/25V  [CAP_C_3225X80]  (masked out: inside a compile mask, not in the netlist)
C147#2  10uF/20V  [CAP_C_2012X110]
C148#1  1uF/20V  [CAP_C_1005X50_L]  (masked out: inside a compile mask, not in the netlist)
C148#2  47uF/25V  [CAP_C_3225X80]
C149#1  1uF/20V  [CAP_C_1005X50_L]  (masked out: inside a compile mask, not in the netlist)
C149#2  47uF/25V  [CAP_C_3225X80]
C150#1  2.2nF/10V  [CAP_C_1005X50_L]  (masked out: inside a compile mask, not in the netlist)
C151#1  2.2nF/10V  [CAP_C_1005X50_L]  (masked out: inside a compile mask, not in the netlist)
C152#1  2.2nF/10V  [CAP_C_1005X50_L]  (masked out: inside a compile mask, not in the netlist)
C153#1  2.2nF/10V  [CAP_C_1005X50_L]  (masked out: inside a compile mask, not in the netlist)
C154#1  10uF/20V  [CAP_C_2012X110]  (masked out: inside a compile mask, not in the netlist)
C155#1  47uF/25V  [CAP_C_3225X80]  (masked out: inside a compile mask, not in the netlist)
C156#1  47uF/25V  [CAP_C_3225X80]  (masked out: inside a compile mask, not in the netlist)
C157#1  47uF/25V  [CAP_C_3225X80]  (masked out: inside a compile mask, not in the netlist)
C158#1  47uF/25V  [CAP_C_3225X80]  (masked out: inside a compile mask, not in the netlist)
C159#1  1uF/20V  [CAP_C_1005X50_L]  (masked out: inside a compile mask, not in the netlist)
C160#1  47uF/25V  [CAP_C_3225X80]  (masked out: inside a compile mask, not in the netlist)
C161#1  47uF/25V  [CAP_C_3225X80]  (masked out: inside a compile mask, not in the netlist)
C162#1  1uF/20V  [CAP_C_1005X50_L]  (masked out: inside a compile mask, not in the netlist)
C163#1  2.2nF/10V  [CAP_C_1005X50_L]  (masked out: inside a compile mask, not in the netlist)
C164#1  2.2nF/10V  [CAP_C_1005X50_L]  (masked out: inside a compile mask, not in the netlist)
C165#1  2.2nF/10V  [CAP_C_1005X50_L]  (masked out: inside a compile mask, not in the netlist)
C166#1  2.2nF/10V  [CAP_C_1005X50_L]  (masked out: inside a compile mask, not in the netlist)
C167#1  47uF/25V  [CAP_C_3225X80]  (masked out: inside a compile mask, not in the netlist)
C168#1  47uF/25V  [CAP_C_3225X80]  (masked out: inside a compile mask, not in the netlist)
C169#1  1uF/20V  [CAP_C_1005X50_L]  (masked out: inside a compile mask, not in the netlist)
C170#1  2.2nF/10V  [CAP_C_1005X50_L]  (masked out: inside a compile mask, not in the netlist)
C171#1  2.2nF/10V  [CAP_C_1005X50_L]  (masked out: inside a compile mask, not in the netlist)
C187  47uF/25V  [CAP_C_3225X80]
D12#1  SS54  [DO-214AC_SMA]  (masked out: inside a compile mask, not in the netlist)
D13#1  SS54  [DO-214AC_SMA]  (masked out: inside a compile mask, not in the netlist)
D13#2  SS54  [DO-214AC_SMA]
D14#1  SS54  [DO-214AC_SMA]  (masked out: inside a compile mask, not in the netlist)
D15#1  SS54  [DO-214AC_SMA]  (masked out: inside a compile mask, not in the netlist)
D16#1  SS54  [DO-214AC_SMA]  (masked out: inside a compile mask, not in the netlist)
D17#1  SS54  [DO-214AC_SMA]  (masked out: inside a compile mask, not in the netlist)
D18#1  SS54  [DO-214AC_SMA]  (masked out: inside a compile mask, not in the netlist)
DS3  _LED_RED  [LED_0402]
DS4  _LED_RED  [LED_0402]
JP3#1  DNP/0R  [JUMPER_1608]  (masked out: inside a compile mask, not in the netlist)
JP3#2  DNP/0R  [JUMPER_1608]
JP4#1  DNP/0R  [JUMPER_1608]  (masked out: inside a compile mask, not in the netlist)
JP5#1  DNP/0R  [JUMPER_1608]  (masked out: inside a compile mask, not in the netlist)
JP6#1  DNP/0R  [JUMPER_1608]  (masked out: inside a compile mask, not in the netlist)
JP7#1  DNP/0R  [JUMPER_1608]  (masked out: inside a compile mask, not in the netlist)
JP8#1  DNP/0R  [JUMPER_1608]  (masked out: inside a compile mask, not in the netlist)
JP9#1  DNP/0R  [JUMPER_1608]  (masked out: inside a compile mask, not in the netlist)
JP10#1  DNP/0R  [JUMPER_1608]  (masked out: inside a compile mask, not in the netlist)
JP11#1  DNP/0R  [JUMPER_1608]  (masked out: inside a compile mask, not in the netlist)
R152#1  470k  [RES_C_1005x30_L]  (masked out: inside a compile mask, not in the netlist)
R153#1  47k  [RES_C_1005x30_L]  (masked out: inside a compile mask, not in the netlist)
R154#1  47k  [RES_C_1005x30_L]  (masked out: inside a compile mask, not in the netlist)
R155#1  470k  [RES_C_1005x30_L]  (masked out: inside a compile mask, not in the netlist)
R156#1  133k  [RES_C_1005x30_L]  (masked out: inside a compile mask, not in the netlist)
R157#1  470k  [RES_C_1005x30_L]  (masked out: inside a compile mask, not in the netlist)
R158#1  47k  [RES_C_1005x30_L]  (masked out: inside a compile mask, not in the netlist)
R159#1  47k  [RES_C_1005x30_L]  (masked out: inside a compile mask, not in the netlist)
R160#1  22R  [RES_C_1005x30_L]  (masked out: inside a compile mask, not in the netlist)
R161#1  1.6k  [RES_C_1005x30_L]  (masked out: inside a compile mask, not in the netlist)
R162#1  DNP/10k  [RES_C_1005x30_L]  (masked out: inside a compile mask, not in the netlist)
R163#1  47k  [RES_C_1005x30_L]  (masked out: inside a compile mask, not in the netlist)
R164#1  10k  [RES_C_1005x30_L]  (masked out: inside a compile mask, not in the netlist)
R165#1  1.6k  [RES_C_1005x30_L]  (masked out: inside a compile mask, not in the netlist)
R166#1  470k  [RES_C_1005x30_L]  (masked out: inside a compile mask, not in the netlist)
R167#1  470k  [RES_C_1005x30_L]  (masked out: inside a compile mask, not in the netlist)
R168#1  47k  [RES_C_1005x30_L]  (masked out: inside a compile mask, not in the netlist)
R169#1  47k  [RES_C_1005x30_L]  (masked out: inside a compile mask, not in the netlist)
R170#1  47k  [RES_C_1005x30_L]  (masked out: inside a compile mask, not in the netlist)
R171#1  47k  [RES_C_1005x30_L]  (masked out: inside a compile mask, not in the netlist)
R172#1  22R  [RES_C_1005x30_L]  (masked out: inside a compile mask, not in the netlist)
R173#1  22R  [RES_C_1005x30_L]  (masked out: inside a compile mask, not in the netlist)
R174#1  DNP/10k  [RES_C_1005x30_L]  (masked out: inside a compile mask, not in the netlist)
R175#1  DNP/10k  [RES_C_1005x30_L]  (masked out: inside a compile mask, not in the netlist)
R176#1  133k  [RES_C_1005x30_L]  (masked out: inside a compile mask, not in the netlist)
R177#1  47k  [RES_C_1005x30_L]  (masked out: inside a compile mask, not in the netlist)
R178#1  10k  [RES_C_1005x30_L]  (masked out: inside a compile mask, not in the netlist)
R179#1  10k  [RES_C_1005x30_L]  (masked out: inside a compile mask, not in the netlist)
R180#1  1.6k  [RES_C_1005x30_L]  (masked out: inside a compile mask, not in the netlist)
R181#1  1.6k  [RES_C_1005x30_L]  (masked out: inside a compile mask, not in the netlist)
R182#1  470k  [RES_C_1005x30_L]  (masked out: inside a compile mask, not in the netlist)
R183#1  47k  [RES_C_1005x30_L]  (masked out: inside a compile mask, not in the netlist)
R184#1  47k  [RES_C_1005x30_L]  (masked out: inside a compile mask, not in the netlist)
R185#1  22R  [RES_C_1005x30_L]  (masked out: inside a compile mask, not in the netlist)
R186#1  DNP/10k  [RES_C_1005x30_L]  (masked out: inside a compile mask, not in the netlist)
R187#1  DNP/10k  [RES_C_1005x30_L]  (masked out: inside a compile mask, not in the netlist)
R188#1  470k  [RES_C_1005x30_L]  (masked out: inside a compile mask, not in the netlist)
R189#1  47k  [RES_C_1005x30_L]  (masked out: inside a compile mask, not in the netlist)
R190#1  10k  [RES_C_1005x30_L]  (masked out: inside a compile mask, not in the netlist)
R191#1  47k  [RES_C_1005x30_L]  (masked out: inside a compile mask, not in the netlist)
R192#1  47k  [RES_C_1005x30_L]  (masked out: inside a compile mask, not in the netlist)
R193#1  22R  [RES_C_1005x30_L]  (masked out: inside a compile mask, not in the netlist)
R194#1  10k  [RES_C_1005x30_L]  (masked out: inside a compile mask, not in the netlist)
R195#1  133k  [RES_C_1005x30_L]  (masked out: inside a compile mask, not in the netlist)
R196#1  1.6k  [RES_C_1005x30_L]  (masked out: inside a compile mask, not in the netlist)
R197#1  1.6k  [RES_C_1005x30_L]  (masked out: inside a compile mask, not in the netlist)
R198#1  DNP/10k  [RES_C_1005x30_L]  (masked out: inside a compile mask, not in the netlist)
R199#1  470k  [RES_C_1005x30_L]  (masked out: inside a compile mask, not in the netlist)
R200#1  47k  [RES_C_1005x30_L]  (masked out: inside a compile mask, not in the netlist)
R201#1  47k  [RES_C_1005x30_L]  (masked out: inside a compile mask, not in the netlist)
R202#1  22R  [RES_C_1005x30_L]  (masked out: inside a compile mask, not in the netlist)
R203#1  10k  [RES_C_1005x30_L]  (masked out: inside a compile mask, not in the netlist)
R204#1  133k  [RES_C_1005x30_L]  (masked out: inside a compile mask, not in the netlist)
R205#1  1.6k  [RES_C_1005x30_L]  (masked out: inside a compile mask, not in the netlist)
R248  DNP/10k  [RES_C_1005x30_L]
R249  470k  [RES_C_1005x30_L]
R250  47k  [RES_C_1005x30_L]
R251  47k  [RES_C_1005x30_L]
R252  10k  [RES_C_1005x30_L]
R253  3.24k  [RES_C_1005x30_L]
R254  133k  [RES_C_1005x30_L]
R255  1.6k  [RES_C_1005x30_L]
R256  3.24k  [RES_C_1005x30_L]
TP3  (no value)  [TP_1mm_SMD]  (no BOM)  (masked out: inside a compile mask, not in the netlist)
TP4  (no value)  [TP_1mm_SMD]  (no BOM)  (masked out: inside a compile mask, not in the netlist)
U22#1  TPS259470ARPWR  [VQFN-HR-10]  (masked out: inside a compile mask, not in the netlist)
U23#1  TPS259470ARPWR  [VQFN-HR-10]  (masked out: inside a compile mask, not in the netlist)
U24#1  TPS259470ARPWR  [VQFN-HR-10]  (masked out: inside a compile mask, not in the netlist)
U24#2  TPS259470ARPWR  [VQFN-HR-10]
U25#1  TPS259470ARPWR  [VQFN-HR-10]  (masked out: inside a compile mask, not in the netlist)
U26#1  TPS259470ARPWR  [VQFN-HR-10]  (masked out: inside a compile mask, not in the netlist)
U27#1  TPS259470ARPWR  [VQFN-HR-10]  (masked out: inside a compile mask, not in the netlist)
U28#1  TPS259470ARPWR  [VQFN-HR-10]  (masked out: inside a compile mask, not in the netlist)
VR2#1  LM1117MP-3.3/NOPB  [VREG_LM1117MP-3.3/NOPB]  (masked out: inside a compile mask, not in the netlist)
VR2#2  LM1117MP-3.3/NOPB  [VREG_LM1117MP-3.3/NOPB]
VR3  LM1117MP-3.3/NOPB  [VREG_LM1117MP-3.3/NOPB]  (masked out: inside a compile mask, not in the netlist)

### Blocks framed on the sheet
EFUSE for SOM: C142#2 C143#2 C144#2 C145#2 C146#2 C187 D13#2 DS3 JP3#2 R248-R255 U24#2
LDO for SOM: C147#2 C148#2 C149#2 DS4 R256 VR2#2

### Nets
3.3V_SAMA7: C148#2.2 C149#2.2 DS4.2(A) VR2#2.2(VOUT_2) VR2#2.4(VOUT_4)
5V_MCU: C144#2.2 C187.2 JP3#2.1 R248.1 R249.2 U24#2.5(IN)
5V_SAMA7: C142#2.2 C143#2.2 C147#2.1 D13#2.1(K) DS3.2(A) JP3#2.2 R250.2 R251.2 U24#2.6(OUT) VR2#2.3(VIN)
GND: C142#2.1 C143#2.1 C144#2.1 C145#2.1 C146#2.1 C147#2.2 C148#2.1 C149#2.1 C187.1 D13#2.2(A) R252.2 R253.1 R254.1 R255.1 R256.1 U24#2.8 VR2#2.1(GND)
eFUSE_ILIM_5V_SOM: R255.2 U24#2.9 ; off-sheet eFUSE_ILIM_5V_SOM
POW_ONOFF_SOM: R248.2 R252.1 U24#2.1(EN/UVLO) ; off-sheet POW_ONOFF_SOM
NetC145#2_2: C145#2.2 U24#2.10
NetC146#2_2: C146#2.2 U24#2.7
NetDS3_1: DS3.1(K) R253.2
NetDS4_1: DS4.1(K) R256.2
NetR249_1: R249.1 R254.2 U24#2.2(OVLO/OVCSEL)
NetR250_1: R250.1 U24#2.3(PG/AUXOFF)
NetR251_1: R251.1 U24#2.4(PGTH/~{FLT})

### Notes on the sheet
- Undervoltage Protector:
- Overvoltage Protector: 1.2*(133+470)/133=5.44V
- Slew Rate: 2000/2200=0.91V/ms
- I-LIM: 3334/1600=2.08A
- Overvoltage Protector: 1.2*(47+470)/47=13.2V
- Undervoltage Protector: NONE
- Project:
- BEE-1012
- Sub-system:
- SATELLITE_EXP_CONTROLLER
- Design by:
- SANG HUYNH
- BAO BUI
- Sheet title:
- Sheet
- A3
- of
- Checked by:
- Approved by:
- VU PHAM
- Revision:
- Document No:
- Size:
- Date:

### Library data of the parts
C131#1 C132#1 C136#1 C137#1 C139#1 C140#1 C141#1 C142#2 C143#2 C144#1 C145#1 C146#1 C147#1 C147#2 C148#2 C149#2 C154#1 C155#1 C156#1 C157#1 C158#1 C160#1 C161#1 C167#1 C168#1 C187 = _CAP_C_High_2: CAP High Value
C133#1 C134#1 C135#1 C138#1 C142#1 C143#1 C144#2 C145#2 C146#2 C148#1 C149#1 C150#1 C151#1 C152#1 C153#1 C159#1 C162#1 C163#1 C164#1 C165#1 C166#1 C169#1 C170#1 C171#1 = _CAP_C_2: CAP
D12#1 D13#1 D13#2 D14#1 D15#1 D16#1 D17#1 D18#1 = DIODE SCHOTTKY
JP3#1 JP3#2 JP4#1 JP5#1 JP6#1 JP7#1 JP8#1 JP9#1 JP10#1 JP11#1 = JUMPER
R152#1 R153#1 R154#1 R155#1 R156#1 R157#1 R158#1 R159#1 R160#1 R161#1 R162#1 R163#1 R164#1 R165#1 R166#1 R167#1 R168#1 R169#1 R170#1 R171#1 R172#1 R173#1 R174#1 R175#1 R176#1 R177#1 R178#1 R179#1 R180#1 R181#1 R182#1 R183#1 R184#1 R185#1 R186#1 R187#1 R188#1 R189#1 R190#1 R191#1 R192#1 R193#1 R194#1 R195#1 R196#1 R197#1 R198#1 R199#1 R200#1 R201#1 R202#1 R203#1 R204#1 R205#1 R248-R256 = _RES_B_2: RES
TP3 TP4 = Test Point: Solder: NF
VR2#1 VR2#2 VR3 = LM1117MP-3.3/NOPB: as VR1#1 on sheet 06_POWER_1; SnapEDA_Link: https://www.snapeda.com/parts/LM1117MP-3.3/NOPB/Texas+Instruments/view-part/?ref=snap; Package: SOT-223-4 Texas Instruments; Value: *; MP: LM1117MP-3.3/NOPB; Check_prices: https://www.snapeda.com/parts/LM1117MP-3.3/NOPB/Texas+Instruments/view-part/?ref=eda

## Sheet 06_POWER_3.SchDoc
size 420 x 297 mm; SheetNumber: 9; SheetTotal: 33
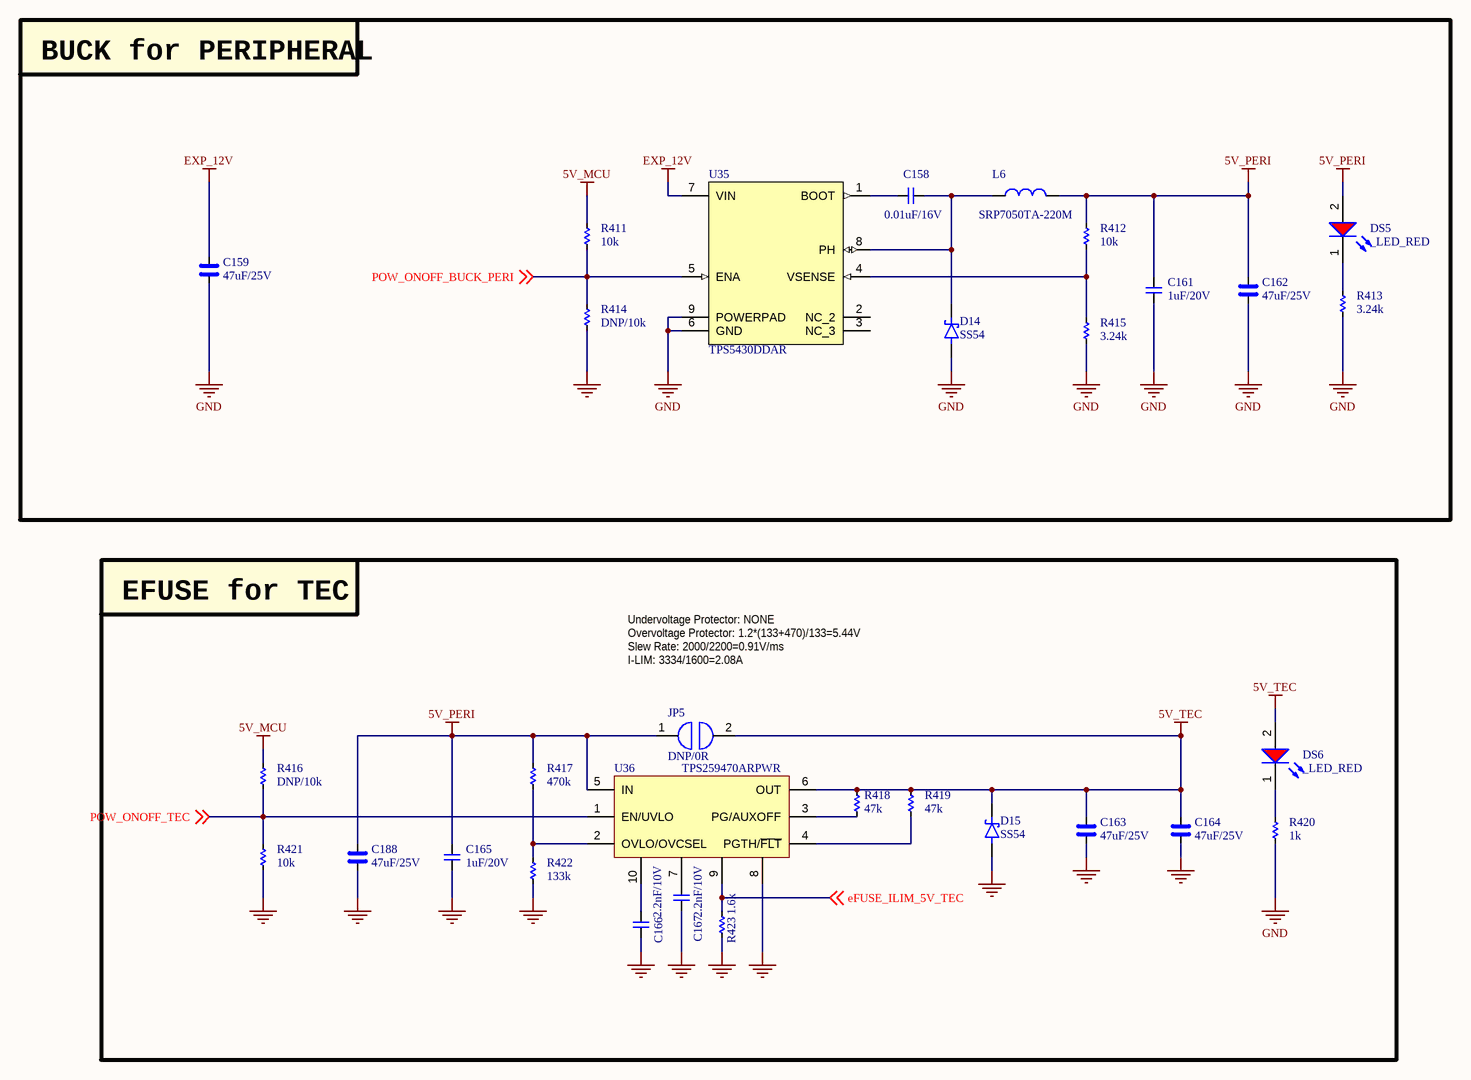
[diagram p10: 06_POWER_3.SchDoc]

### Parts
(Parts that share a designator on the sheet are numbered #1, #2 ... from top to bottom, then left to right.)
C158#2  0.01uF/16V  [CAP_C_1608X80]
C159#2  47uF/25V  [CAP_C_3225X80]
C161#2  1uF/20V  [CAP_C_1005X50_L]
C162#2  47uF/25V  [CAP_C_3225X80]
C163#2  47uF/25V  [CAP_C_3225X80]
C164#2  47uF/25V  [CAP_C_3225X80]
C165#2  1uF/20V  [CAP_C_1005X50_L]
C166#2  2.2nF/10V  [CAP_C_1005X50_L]
C167#2  2.2nF/10V  [CAP_C_1005X50_L]
C188  47uF/25V  [CAP_C_3225X80]
D14#2  SS54  [DO-214AC_SMA]
D15#2  SS54  [DO-214AC_SMA]
DS5  _LED_RED  [LED_0402]
DS6  _LED_RED  [LED_0402]
JP5#2  DNP/0R  [JUMPER_1608]
L6  SRP7050TA-220M  [PSM6050]
R411  10k  [RES_C_1005x30_L]
R412  10k  [RES_C_1005x30_L]
R413  3.24k  [RES_C_1005x30_L]
R414  DNP/10k  [RES_C_1005x30_L]
R415  3.24k  [RES_C_1005x30_L]
R416  DNP/10k  [RES_C_1005x30_L]
R417  470k  [RES_C_1005x30_L]
R418  47k  [RES_C_1005x30_L]
R419  47k  [RES_C_1005x30_L]
R420  1k  [RES_C_1005x30_L]
R421  10k  [RES_C_1005x30_L]
R422  133k  [RES_C_1005x30_L]
R423  1.6k  [RES_C_1005x30_L]
U35  TPS5430DDAR  [TPS5430DDAR_V3]
U36  TPS259470ARPWR  [VQFN-HR-10]

### Blocks framed on the sheet
BUCK for PERIPHERAL: C158#2 C159#2 C161#2 C162#2 D14#2 DS5 L6 R411-R415 U35
EFUSE for TEC: C163#2 C164#2 C165#2 C166#2 C167#2 C188 D15#2 DS6 JP5#2 R416-R423 U36

### Nets
5V_MCU: R411.1 R416.1
5V_PERI: C161#2.2 C162#2.2 C165#2.2 C188.2 DS5.2(A) JP5#2.1 L6.2 R412.2 R417.2 U36.5(IN)
5V_TEC: C163#2.2 C164#2.2 D15#2.1(K) DS6.2(A) JP5#2.2 R418.2 R419.2 U36.6(OUT)
EXP_12V: C159#2.2 U35.7(VIN)
GND: C159#2.1 C161#2.1 C162#2.1 C163#2.1 C164#2.1 C165#2.1 C166#2.1 C167#2.1 C188.1 D14#2.2(A) D15#2.2(A) R413.1 R414.2 R415.1 R420.1 R421.2 R422.1 R423.1 U35.6(GND) U35.9(POWERPAD) U36.8
eFUSE_ILIM_5V_TEC: R423.2 U36.9 ; off-sheet eFUSE_ILIM_5V_TEC
POW_ONOFF_BUCK_PERI: R411.2 R414.1 U35.5(ENA) ; off-sheet POW_ONOFF_BUCK_PERI
POW_ONOFF_TEC: R416.2 R421.1 U36.1(EN/UVLO) ; off-sheet POW_ONOFF_TEC
NetC158#2_1: C158#2.1 D14#2.1(K) L6.1 U35.8(PH)
NetC158#2_2: C158#2.2 U35.1(BOOT)
NetC166#2_2: C166#2.2 U36.10
NetC167#2_2: C167#2.2 U36.7
NetDS5_1: DS5.1(K) R413.2
NetDS6_1: DS6.1(K) R420.2
NetR412_1: R412.1 R415.2 U35.4(VSENSE)
NetR417_1: R417.1 R422.2 U36.2(OVLO/OVCSEL)
NetR418_1: R418.1 U36.3(PG/AUXOFF)
NetR419_1: R419.1 U36.4(PGTH/~{FLT})

Not connected (* = marked no-connect by the designer): U35 2(NC_2) 3(NC_3)

### Notes on the sheet
- Undervoltage Protector: NONE
- Overvoltage Protector: 1.2*(133+470)/133=5.44V
- Slew Rate: 2000/2200=0.91V/ms
- I-LIM: 3334/1600=2.08A
- Project:
- BEE-1012
- Sub-system:
- SATELLITE_EXP_CONTROLLER
- Design by:
- SANG HUYNH
- BAO BUI
- Sheet title:
- Sheet
- A3
- of
- Checked by:
- Approved by:
- VU PHAM
- Revision:
- Document No:
- Size:
- Date:

### Library data of the parts
C158#2 C161#2 C165#2 C166#2 C167#2 = _CAP_C_2: CAP
C159#2 C162#2 C163#2 C164#2 C188 = _CAP_C_High_2: CAP High Value
D14#2 D15#2 = DIODE SCHOTTKY
JP5#2 = JUMPER
L6 = SRP7050TA-220M: FIXED IND 22UH 2.5A 170 MOHM SMD
R411-R423 = _RES_B_2: RES
U35 = TPS5430DDAR: IC REG BUCK ADJ 3A 8SOPWR

## Sheet 06_POWER_4.SchDoc
size 420 x 297 mm; SheetNumber: 10; SheetTotal: 33
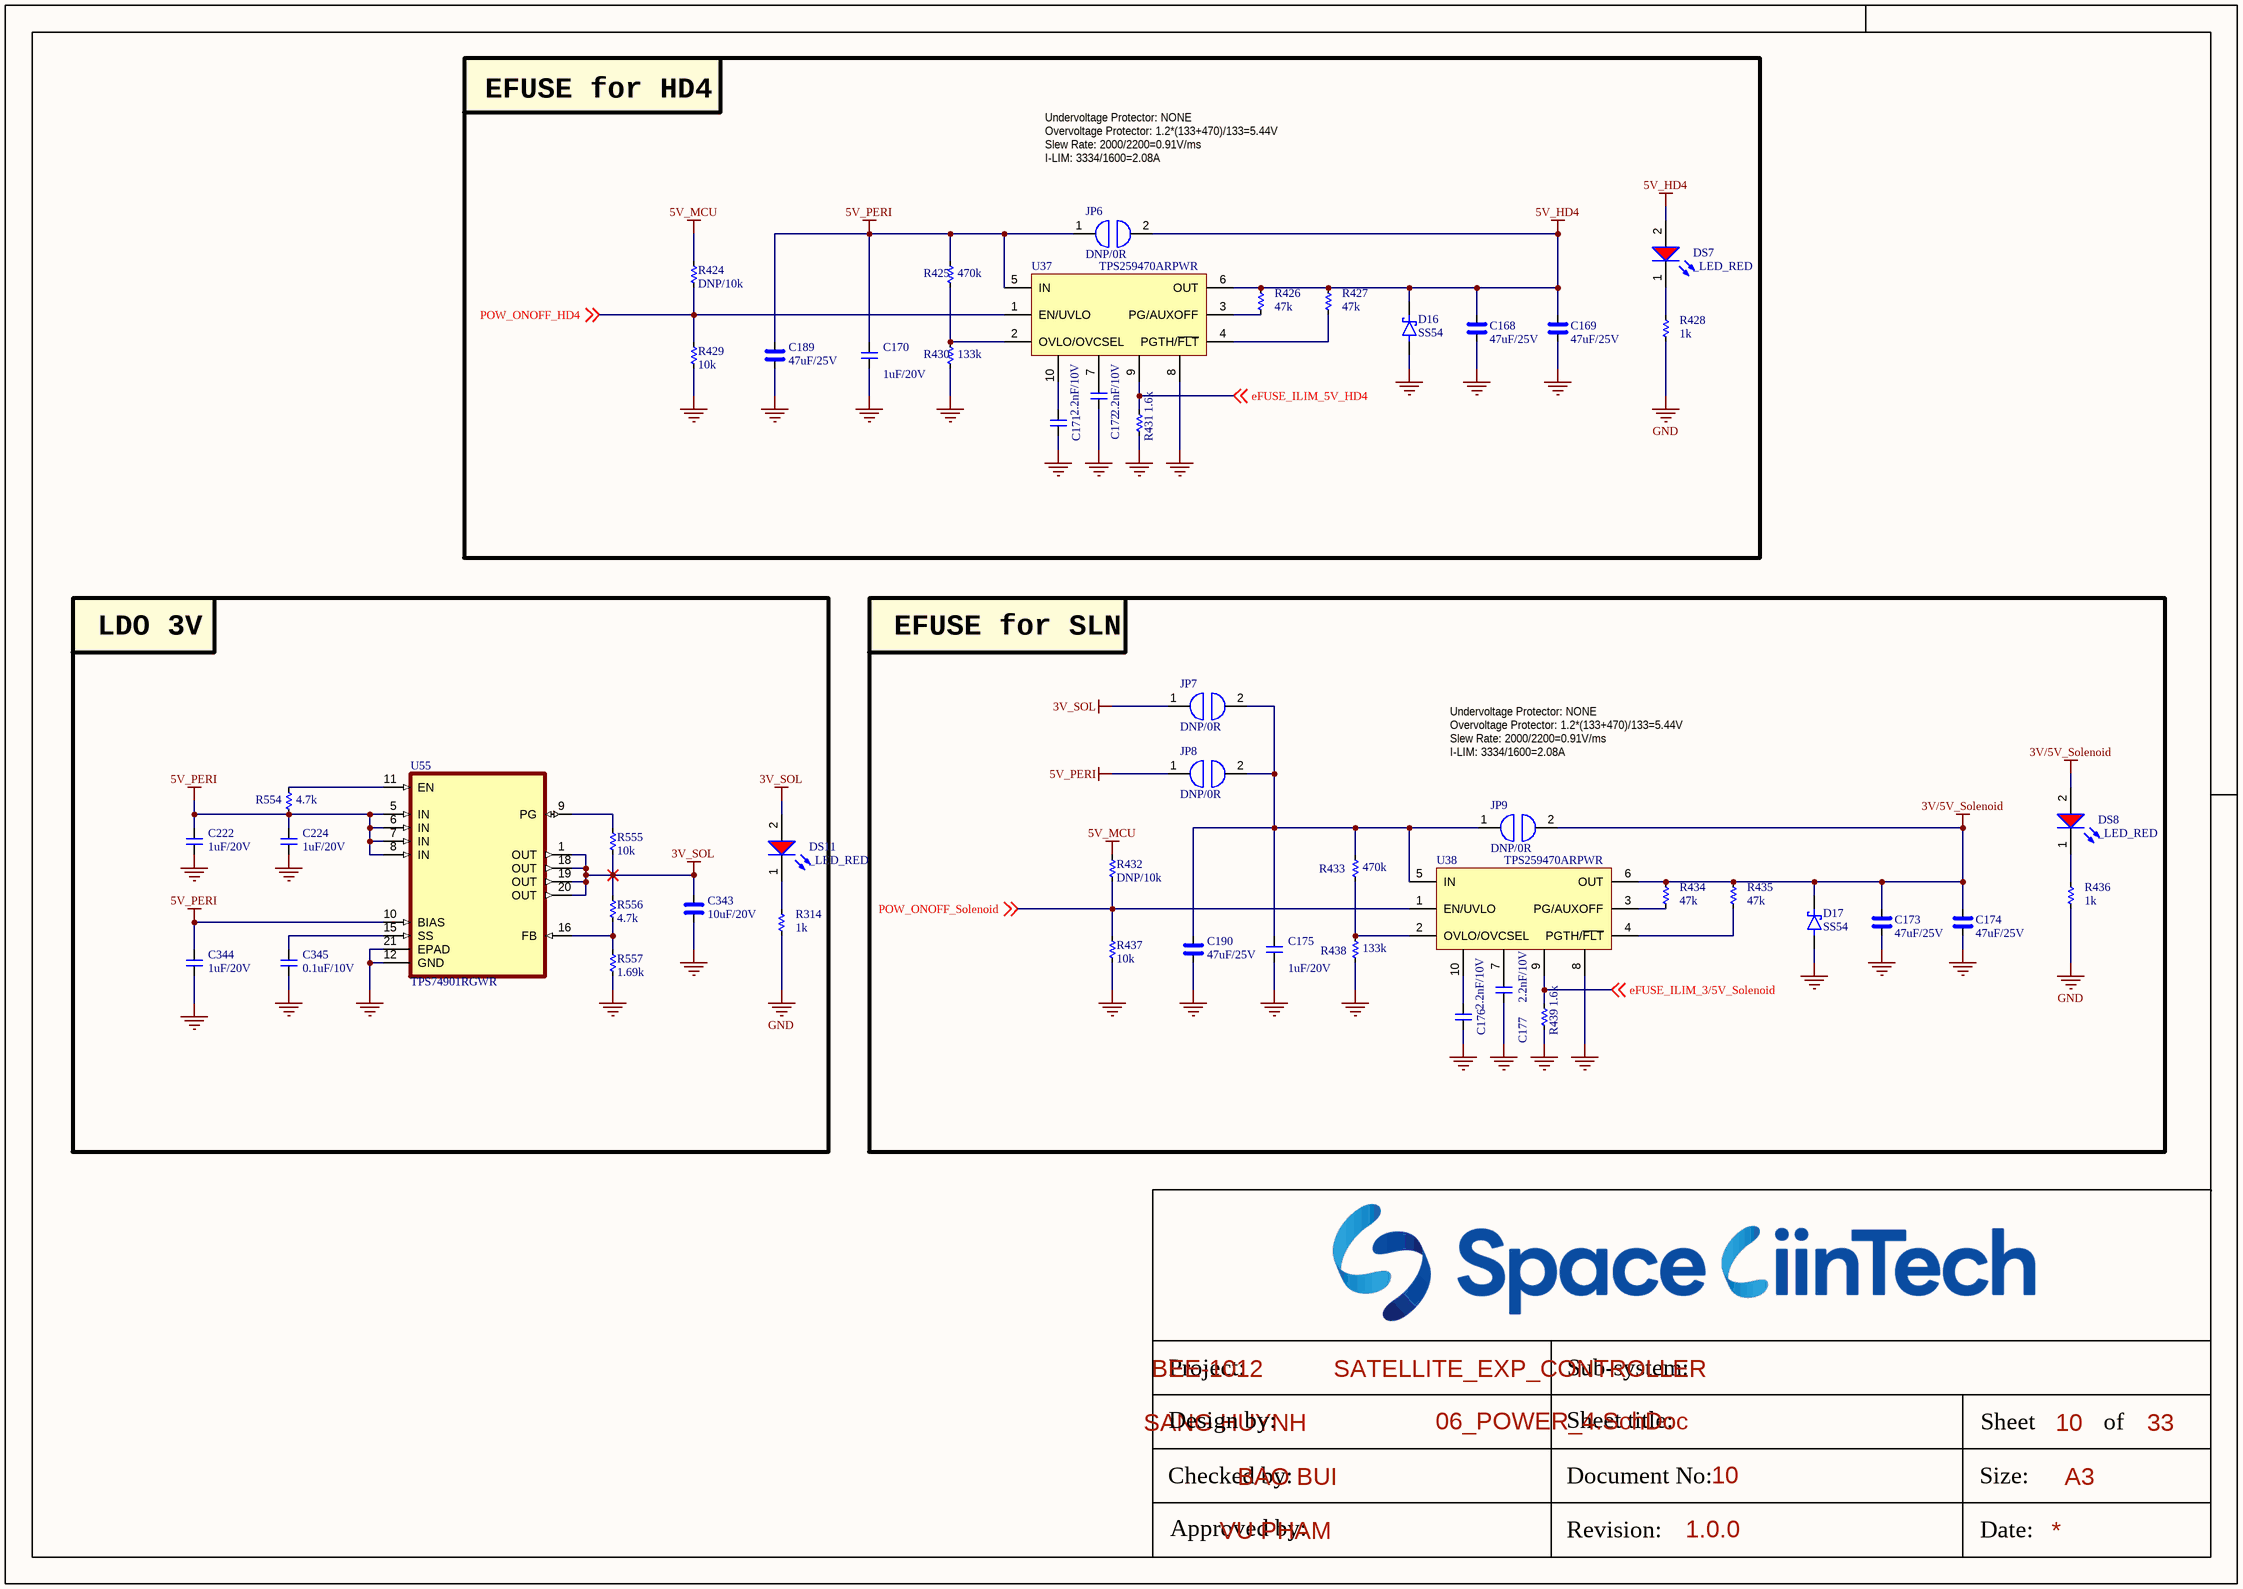
[diagram p11: 06_POWER_4.SchDoc]

### Parts
(Parts that share a designator on the sheet are numbered #1, #2 ... from top to bottom, then left to right.)
C168#2  47uF/25V  [CAP_C_3225X80]
C169#2  47uF/25V  [CAP_C_3225X80]
C170#2  1uF/20V  [CAP_C_1005X50_L]
C171#2  2.2nF/10V  [CAP_C_1005X50_L]
C172  2.2nF/10V  [CAP_C_1005X50_L]
C173  47uF/25V  [CAP_C_3225X80]
C174  47uF/25V  [CAP_C_3225X80]
C175  1uF/20V  [CAP_C_1005X50_L]
C176  2.2nF/10V  [CAP_C_1005X50_L]
C177  2.2nF/10V  [CAP_C_1005X50_L]
C189  47uF/25V  [CAP_C_3225X80]
C190  47uF/25V  [CAP_C_3225X80]
C222  1uF/20V  [CAP_C_1005X50_L]
C224  1uF/20V  [CAP_C_1005X50_L]
C343  10uF/20V  [CAP_C_2012X110]
C344  1uF/20V  [CAP_C_1005X50_L]
C345  0.1uF/10V  [CAP_C_1005X50_L]
D16#2  SS54  [DO-214AC_SMA]
D17#2  SS54  [DO-214AC_SMA]
DS7  _LED_RED  [LED_0402]
DS8  _LED_RED  [LED_0402]
DS11  _LED_RED  [LED_0402]
JP6#2  DNP/0R  [JUMPER_1608]
JP7#2  DNP/0R  [JUMPER_1608]
JP8#2  DNP/0R  [JUMPER_1608]
JP9#2  DNP/0R  [JUMPER_1608]
R314  1k  [RES_C_1005x30_L]
R424  DNP/10k  [RES_C_1005x30_L]
R425  470k  [RES_C_1005x30_L]
R426  47k  [RES_C_1005x30_L]
R427  47k  [RES_C_1005x30_L]
R428  1k  [RES_C_1005x30_L]
R429  10k  [RES_C_1005x30_L]
R430  133k  [RES_C_1005x30_L]
R431  1.6k  [RES_C_1005x30_L]
R432  DNP/10k  [RES_C_1005x30_L]
R433  470k  [RES_C_1005x30_L]
R434  47k  [RES_C_1005x30_L]
R435  47k  [RES_C_1005x30_L]
R436  1k  [RES_C_1005x30_L]
R437  10k  [RES_C_1005x30_L]
R438  133k  [RES_C_1005x30_L]
R439  1.6k  [RES_C_1005x30_L]
R554  4.7k  [RES_C_1005x30_L]
R555  10k  [RES_C_1005x30_L]
R556  4.7k  [RES_C_1005x30_L]
R557  1.69k  [RES_C_1005x30_L]
U37  TPS259470ARPWR  [VQFN-HR-10]
U38  TPS259470ARPWR  [VQFN-HR-10]
U55  TPS74901RGWR  [QFN65P500X500X100-21N]

### Blocks framed on the sheet
EFUSE for HD4: C168#2 C169#2 C170#2 C171#2 C172 C189 D16#2 DS7 JP6#2 R424-R431 U37
LDO 3V: C222 C224 C343-C345 DS11 R314 R554-R557 U55
EFUSE for SLN: C173-C177 C190 D17#2 DS8 JP7#2 JP8#2 JP9#2 R432-R439 U38

### Nets
3V/5V_Solenoid: C173.2 C174.2 D17#2.1(K) DS8.2(A) JP9#2.2 R434.2 R435.2 U38.6(OUT)
3V_SOL: C343.1 DS11.2(A) JP7#2.1 R555.2 R556.1 U55.1(OUT) U55.18(OUT) U55.19(OUT) U55.20(OUT)
5V_HD4: C168#2.2 C169#2.2 D16#2.1(K) DS7.2(A) JP6#2.2 R426.2 R427.2 U37.6(OUT)
5V_MCU: R424.1 R432.1
5V_PERI: C170#2.2 C189.2 C222.2 C224.2 C344.2 JP6#2.1 JP8#2.1 R425.2 R554.2 U37.5(IN) U55.5(IN) U55.6(IN) U55.7(IN) U55.8(IN) U55.10(BIAS)
GND: C168#2.1 C169#2.1 C170#2.1 C171#2.1 C172.1 C173.1 C174.1 C175.1 C176.1 C177.1 C189.1 C190.1 C222.1 C224.1 C343.2 C344.1 C345.1 D16#2.2(A) D17#2.2(A) R314.1 R428.1 R429.2 R430.1 R431.1 R436.1 R437.2 R438.1 R439.1 R557.2 U37.8 U38.8 U55.12(GND) U55.21(EPAD)
eFUSE_ILIM_3/5V_Solenoid: R439.2 U38.9 ; off-sheet eFUSE_ILIM_3/5V_Solenoid
eFUSE_ILIM_5V_HD4: R431.2 U37.9 ; off-sheet eFUSE_ILIM_5V_HD4
POW_ONOFF_HD4: R424.2 R429.1 U37.1(EN/UVLO) ; off-sheet POW_ONOFF_HD4
POW_ONOFF_Solenoid: R432.2 R437.1 U38.1(EN/UVLO) ; off-sheet POW_ONOFF_Solenoid
NetC171#2_2: C171#2.2 U37.10
NetC172_2: C172.2 U37.7
NetC175_2: C175.2 C190.2 JP7#2.2 JP8#2.2 JP9#2.1 R433.2 U38.5(IN)
NetC176_2: C176.2 U38.10
NetC177_2: C177.2 U38.7
NetC345_2: C345.2 U55.15(SS)
NetDS7_1: DS7.1(K) R428.2
NetDS8_1: DS8.1(K) R436.2
NetDS11_1: DS11.1(K) R314.2
NetR425_1: R425.1 R430.2 U37.2(OVLO/OVCSEL)
NetR426_1: R426.1 U37.3(PG/AUXOFF)
NetR427_1: R427.1 U37.4(PGTH/~{FLT})
NetR433_1: R433.1 R438.2 U38.2(OVLO/OVCSEL)
NetR434_1: R434.1 U38.3(PG/AUXOFF)
NetR435_1: R435.1 U38.4(PGTH/~{FLT})
NetR554_1: R554.1 U55.11(EN)
NetR555_1: R555.1 U55.9(PG)
NetR556_2: R556.2 R557.1 U55.16(FB)

### Notes on the sheet
- Undervoltage Protector: NONE
- Overvoltage Protector: 1.2*(133+470)/133=5.44V
- Slew Rate: 2000/2200=0.91V/ms
- I-LIM: 3334/1600=2.08A
- Project:
- BEE-1012
- Sub-system:
- SATELLITE_EXP_CONTROLLER
- Design by:
- SANG HUYNH
- BAO BUI
- Sheet title:
- Sheet
- A3
- of
- Checked by:
- Approved by:
- VU PHAM
- Revision:
- Document No:
- Size:
- Date:

### Library data of the parts
C168#2 C169#2 C173 C174 C189 C190 C343 = _CAP_C_High_2: CAP High Value
C170#2 C171#2 C172 C175-C177 C222 C224 C344 C345 = _CAP_C_2: CAP
D16#2 D17#2 = DIODE SCHOTTKY
JP6#2 JP7#2 JP8#2 JP9#2 = JUMPER
R314 R424-R439 R554-R557 = _RES_B_2: RES
U55 = IC_PWR_TPS74901RGWR: 3-A, low-VIN (0.8-V), adjustable ultra-low-dropout voltage regulator with power good & enable 20-VQFN -40 to 125; MF: Texas Instruments; Price: None; Check_prices: https://www.snapeda.com/parts/TPS74901RGWR/Texas%20Instruments/view-part/1101342/?ref=eda; SnapEDA_Link: https://www.snapeda.com/parts/TPS74901RGWR/Texas%20Instruments/view-part/1101342/?ref=snap; Package: VQFN-20 Texas Instruments; Purchase-URL: https://pricing.snapeda.com/search/part/TPS74901RGWR/?ref=eda; Availability: Good; MP: TPS74901RGWR; Value: *

## Sheet 06_POWER_5.SchDoc
size 420 x 297 mm; SheetNumber: 11; SheetTotal: 33
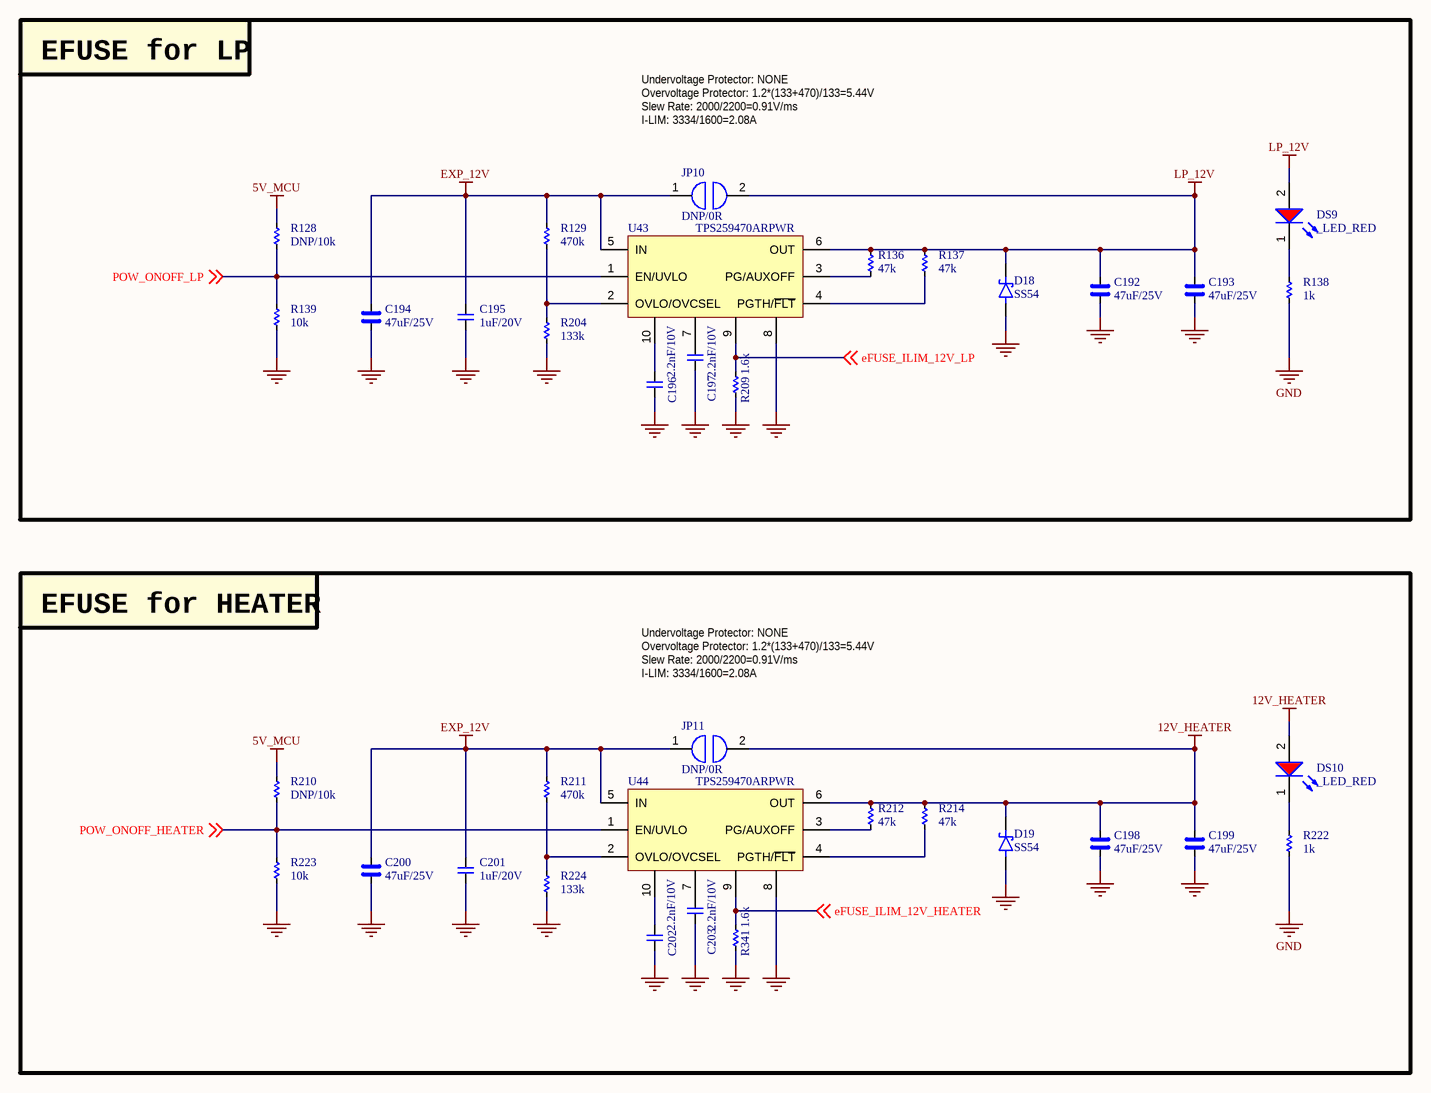
[diagram p12: 06_POWER_5.SchDoc]

### Parts
(Parts that share a designator on the sheet are numbered #1, #2 ... from top to bottom, then left to right.)
C192  47uF/25V  [CAP_C_3225X80]
C193  47uF/25V  [CAP_C_3225X80]
C194  47uF/25V  [CAP_C_3225X80]
C195  1uF/20V  [CAP_C_1005X50_L]
C196  2.2nF/10V  [CAP_C_1005X50_L]
C197  2.2nF/10V  [CAP_C_1005X50_L]
C198  47uF/25V  [CAP_C_3225X80]
C199  47uF/25V  [CAP_C_3225X80]
C200  47uF/25V  [CAP_C_3225X80]
C201  1uF/20V  [CAP_C_1005X50_L]
C202  2.2nF/10V  [CAP_C_1005X50_L]
C203  2.2nF/10V  [CAP_C_1005X50_L]
D18#2  SS54  [DO-214AC_SMA]
D19  SS54  [DO-214AC_SMA]
DS9  _LED_RED  [LED_0402]
DS10  _LED_RED  [LED_0402]
JP10#2  DNP/0R  [JUMPER_1608]
JP11#2  DNP/0R  [JUMPER_1608]
R128  DNP/10k  [RES_C_1005x30_L]
R129  470k  [RES_C_1005x30_L]
R136  47k  [RES_C_1005x30_L]
R137  47k  [RES_C_1005x30_L]
R138  1k  [RES_C_1005x30_L]
R139  10k  [RES_C_1005x30_L]
R204#2  133k  [RES_C_1005x30_L]
R209  1.6k  [RES_C_1005x30_L]
R210  DNP/10k  [RES_C_1005x30_L]
R211  470k  [RES_C_1005x30_L]
R212  47k  [RES_C_1005x30_L]
R214  47k  [RES_C_1005x30_L]
R222  1k  [RES_C_1005x30_L]
R223  10k  [RES_C_1005x30_L]
R224  133k  [RES_C_1005x30_L]
R341  1.6k  [RES_C_1005x30_L]
U43  TPS259470ARPWR  [VQFN-HR-10]
U44  TPS259470ARPWR  [VQFN-HR-10]

### Blocks framed on the sheet
EFUSE for LP: C192-C197 D18#2 DS9 JP10#2 R128 R129 R136-R139 R204#2 R209 U43
EFUSE for HEATER: C198-C203 D19 DS10 JP11#2 R210-R212 R214 R222-R224 R341 U44

### Nets
5V_MCU: R128.1 R210.1
12V_HEATER: C198.2 C199.2 D19.1(K) DS10.2(A) JP11#2.2 R212.2 R214.2 U44.6(OUT)
EXP_12V: C194.2 C195.2 C200.2 C201.2 JP10#2.1 JP11#2.1 R129.2 R211.2 U43.5(IN) U44.5(IN)
GND: C192.1 C193.1 C194.1 C195.1 C196.1 C197.1 C198.1 C199.1 C200.1 C201.1 C202.1 C203.1 D18#2.2(A) D19.2(A) R138.1 R139.2 R204#2.1 R209.1 R222.1 R223.2 R224.1 R341.1 U43.8 U44.8
LP_12V: C192.2 C193.2 D18#2.1(K) DS9.2(A) JP10#2.2 R136.2 R137.2 U43.6(OUT)
eFUSE_ILIM_12V_HEATER: R341.2 U44.9 ; off-sheet eFUSE_ILIM_12V_HEATER
eFUSE_ILIM_12V_LP: R209.2 U43.9 ; off-sheet eFUSE_ILIM_12V_LP
POW_ONOFF_HEATER: R210.2 R223.1 U44.1(EN/UVLO) ; off-sheet POW_ONOFF_HEATER
POW_ONOFF_LP: R128.2 R139.1 U43.1(EN/UVLO) ; off-sheet POW_ONOFF_LP
NetC196_2: C196.2 U43.10
NetC197_2: C197.2 U43.7
NetC202_2: C202.2 U44.10
NetC203_2: C203.2 U44.7
NetDS9_1: DS9.1(K) R138.2
NetDS10_1: DS10.1(K) R222.2
NetR129_1: R129.1 R204#2.2 U43.2(OVLO/OVCSEL)
NetR136_1: R136.1 U43.3(PG/AUXOFF)
NetR137_1: R137.1 U43.4(PGTH/~{FLT})
NetR211_1: R211.1 R224.2 U44.2(OVLO/OVCSEL)
NetR212_1: R212.1 U44.3(PG/AUXOFF)
NetR214_1: R214.1 U44.4(PGTH/~{FLT})

### Notes on the sheet
- Undervoltage Protector: NONE
- Overvoltage Protector: 1.2*(133+470)/133=5.44V
- Slew Rate: 2000/2200=0.91V/ms
- I-LIM: 3334/1600=2.08A
- Project:
- BEE-1012
- Sub-system:
- SATELLITE_EXP_CONTROLLER
- Design by:
- SANG HUYNH
- BAO BUI
- Sheet title:
- Sheet
- A3
- of
- Checked by:
- Approved by:
- VU PHAM
- Revision:
- Document No:
- Size:
- Date:

### Library data of the parts
C192-C194 C198-C200 = _CAP_C_High_2: CAP High Value
C195-C197 C201-C203 = _CAP_C_2: CAP
D18#2 D19 = DIODE SCHOTTKY
JP10#2 JP11#2 = JUMPER
R128 R129 R136-R139 R204#2 R209-R212 R214 R222-R224 R341 = _RES_B_2: RES

## Sheet 07_CAN.SchDoc
size 420 x 297 mm; SheetNumber: 12; SheetTotal: 33
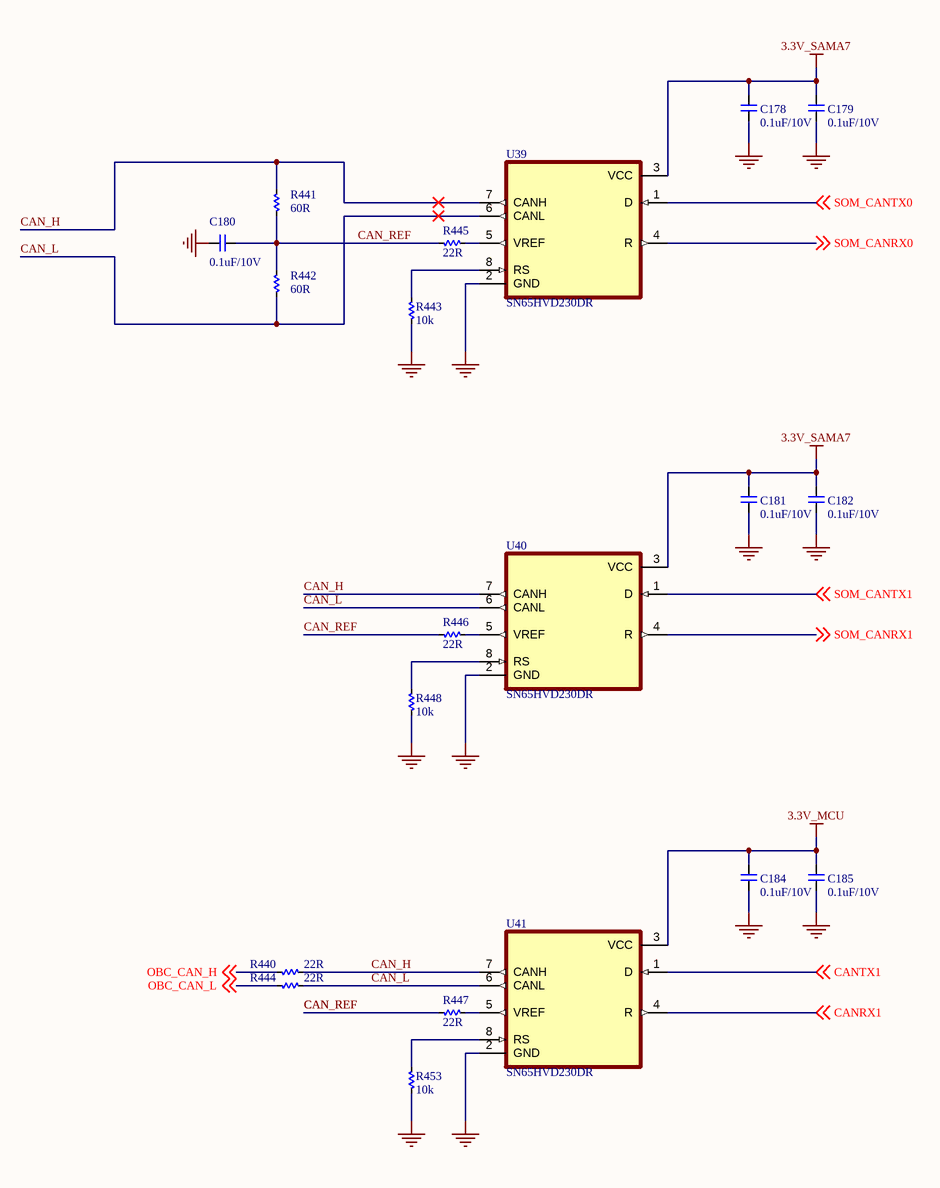
[diagram p13: 07_CAN.SchDoc]

### Parts
C178  0.1uF/10V  [CAP_C_1005X50_L]
C179  0.1uF/10V  [CAP_C_1005X50_L]
C180  0.1uF/10V  [CAP_C_1005X50_L]
C181  0.1uF/10V  [CAP_C_1005X50_L]
C182  0.1uF/10V  [CAP_C_1005X50_L]
C184  0.1uF/10V  [CAP_C_1005X50_L]
C185  0.1uF/10V  [CAP_C_1005X50_L]
R440  22R  [RES_C_1005x30_L]
R441  60R  [RES_C_1005x30_L]
R442  60R  [RES_C_1005x30_L]
R443  10k  [RES_C_1005x30_L]
R444  22R  [RES_C_1005x30_L]
R445  22R  [RES_C_1005x30_L]
R446  22R  [RES_C_1005x30_L]
R447  22R  [RES_C_1005x30_L]
R448  10k  [RES_C_1005x30_L]
R453  10k  [RES_C_1005x30_L]
U39  SN65HVD230DR  [SOIC127P599X175-8N]
U40  SN65HVD230DR  [SOIC127P599X175-8N]
U41  SN65HVD230DR  [SOIC127P599X175-8N]

### Nets
3.3V_MCU: C184.1 C185.1 U41.3(VCC)
3.3V_SAMA7: C178.1 C179.1 C181.1 C182.1 U39.3(VCC) U40.3(VCC)
GND: C178.2 C179.2 C180.2 C181.2 C182.2 C184.2 C185.2 R443.1 R448.1 R453.1 U39.2(GND) U40.2(GND) U41.2(GND)
CAN_H: R440.2 R441.2 U39.7(CANH) U40.7(CANH) U41.7(CANH)
CAN_L: R442.1 R444.2 U39.6(CANL) U40.6(CANL) U41.6(CANL)
CAN_REF: C180.1 R441.1 R442.2 R445.1 R446.1 R447.1
CANRX1: U41.4(R) ; off-sheet CANRX1
CANTX1: U41.1(D) ; off-sheet CANTX1
OBC_CAN_H: R440.1 ; off-sheet OBC_CAN_H  [project net OBC_CANH]
OBC_CAN_L: R444.1 ; off-sheet OBC_CAN_L  [project net OBC_CANL]
SOM_CANRX0: U39.4(R) ; off-sheet SOM_CANRX0
SOM_CANRX1: U40.4(R) ; off-sheet SOM_CANRX1
SOM_CANTX0: U39.1(D) ; off-sheet SOM_CANTX0
SOM_CANTX1: U40.1(D) ; off-sheet SOM_CANTX1
NetR443_2: R443.2 U39.8(RS)
NetR445_2: R445.2 U39.5(VREF)
NetR446_2: R446.2 U40.5(VREF)
NetR447_2: R447.2 U41.5(VREF)
NetR448_2: R448.2 U40.8(RS)
NetR453_2: R453.2 U41.8(RS)

### Notes on the sheet
- Project:
- BEE-1012
- Sub-system:
- SATELLITE_EXP_CONTROLLER
- Design by:
- SANG HUYNH
- BAO BUI
- Sheet title:
- Sheet
- A3
- of
- Checked by:
- Approved by:
- VU PHAM
- Revision:
- Document No:
- Size:
- Date:

### Library data of the parts
C178-C182 C184 C185 = _CAP_C_2: CAP
R440-R448 R453 = _RES_B_2: RES
U39-U41 = SN65HVD230DR: 3.3 V CAN Transceiver with Standby Mode; MF: Texas Instruments; SnapEDA_Link: https://www.snapeda.com/parts/SN65HVD230DR/Texas+Instruments/view-part/?ref=snap; Package: SOIC-8 Texas Instruments; Value: *; MP: SN65HVD230DR; Check_prices: https://www.snapeda.com/parts/SN65HVD230DR/Texas+Instruments/view-part/?ref=eda